# Altium project BOC1_06.PrjPcb (part 1 of 2)
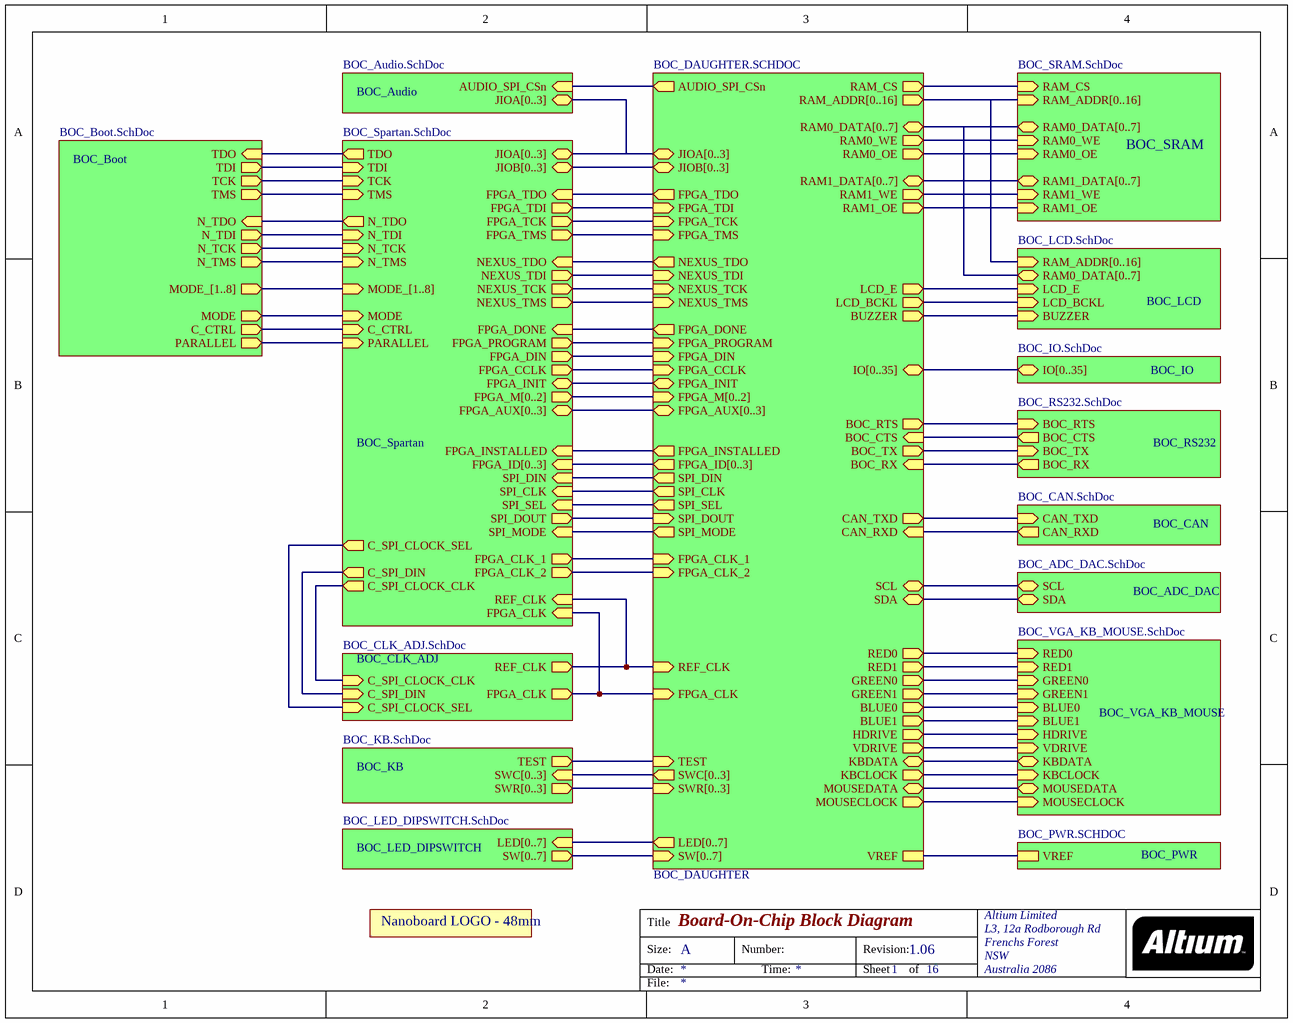
[diagram p0: BOC_Top.SchDoc]
16 sheets, 311 parts. Net scope: hierarchical (ports join the sheet entries above them; power ports are global).
Board file: BOC1_06.PcbDoc
Sheets:
  BOC_Top.SchDoc
    BOC_SRAM = BOC_SRAM.SchDoc
    BOC_IO = BOC_IO.SchDoc
    BOC_KB = BOC_KB.SchDoc
    BOC_PWR = BOC_PWR.SchDoc
    BOC_RS232 = BOC_RS232.SchDoc
    BOC_ADC_DAC = BOC_ADC_DAC.SchDoc
    BOC_CAN = BOC_CAN.SchDoc
    BOC_LED_DIPSWITCH = BOC_LED_DIPSWITCH.SchDoc
    BOC_CLK_ADJ = BOC_CLK_ADJ.SchDoc
    BOC_LCD = BOC_LCD.SchDoc
    BOC_VGA_KB_MOUSE = BOC_VGA_KB_MOUSE.SchDoc
    BOC_Spartan = BOC_Spartan.SchDoc
    BOC_DAUGHTER = BOC_DAUGHTER.SchDoc
    BOC_Boot = BOC_Boot.SchDoc
    BOC_Audio = BOC_Audio.SchDoc

## Sheet BOC_Top.SchDoc: Board-On-Chip Block Diagram
size A; Organization: Altium Limited; Address1: L3, 12a Rodborough Rd; Address2: Frenchs Forest; Address3: NSW; Address4: Australia 2086; Revision: 1.06; SheetNumber: 1; SheetTotal: 16

### Parts
LOGO1  NanoboardLogo48mm  [NanoboardLogo48mm]  (value not drawn)  (graphical)

### Sub-sheets
BOC_ADC_DAC = BOC_ADC_DAC.SchDoc: SCL (bidir), SDA (bidir)
BOC_Audio = BOC_Audio.SchDoc: AUDIO_SPI_CSn (in), JIOA[0..3] (bidir)
BOC_Boot = BOC_Boot.SchDoc: TCK (out), TDO (in), TDI (out), TMS (out), C_CTRL (out), PARALLEL (out), MODE_[1..8] (out), N_TDI (out), N_TDO (in), N_TCK (out), N_TMS (out), MODE (out)
BOC_CAN = BOC_CAN.SchDoc: CAN_TXD (in), CAN_RXD (out)
BOC_CLK_ADJ = BOC_CLK_ADJ.SchDoc: FPGA_CLK (out), REF_CLK (out), C_SPI_CLOCK_SEL (in), C_SPI_DIN (in), C_SPI_CLOCK_CLK (in)
BOC_DAUGHTER = BOC_DAUGHTER.SCHDOC: FPGA_DONE (out), FPGA_PROGRAM (in), FPGA_CCLK (in), FPGA_DIN (in), IO[0..35] (bidir), BOC_RTS (out), BOC_TX (out), BOC_CTS (in), BOC_RX (in), CAN_TXD (out), CAN_RXD (in), JIOA[0..3] (bidir), JIOB[0..3] (bidir), LED[0..7] (out), SW[0..7] (in), LCD_BCKL (out), FPGA_AUX[0..3] (bidir), FPGA_M[0..2] (in), FPGA_TDI (in), FPGA_TCK (in), FPGA_TMS (in), FPGA_TDO (out), RAM_ADDR[0..16] (out), RAM0_DATA[0..7] (bidir), RAM1_DATA[0..7] (bidir), RAM0_OE (out), RAM0_WE (out), RAM1_OE (out), RAM1_WE (out), RAM_CS (out), RED0 (out), RED1 (out), GREEN0 (out), GREEN1 (out), BLUE0 (out), BLUE1 (out), HDRIVE (out), VDRIVE (out), KBDATA (bidir), KBCLOCK (out), MOUSEDATA (bidir), MOUSECLOCK (out), SWC[0..3] (out), SWR[0..3] (in), FPGA_CLK (in), TEST (in), SCL (bidir), SDA (bidir), NEXUS_TDI (in), NEXUS_TCK (in), NEXUS_TMS (in), NEXUS_TDO (out), BUZZER (out), FPGA_INIT (bidir), VREF, SPI_MODE (out), SPI_DOUT (in), SPI_SEL (out), SPI_CLK (out), SPI_DIN (out), FPGA_CLK_1 (in), FPGA_CLK_2 (in), FPGA_INSTALLED (out), REF_CLK (in), FPGA_ID[0..3] (out), LCD_E (out), AUDIO_SPI_CSn (out)
BOC_IO = BOC_IO.SchDoc: IO[0..35] (bidir)
BOC_KB = BOC_KB.SchDoc: SWC[0..3] (in), SWR[0..3] (out), TEST (out)
BOC_LCD = BOC_LCD.SchDoc: RAM0_DATA[0..7] (bidir), LCD_BCKL (in), RAM_ADDR[0..16] (in), BUZZER (in), LCD_E (in)
BOC_LED_DIPSWITCH = BOC_LED_DIPSWITCH.SchDoc: LED[0..7] (in), SW[0..7] (out)
BOC_PWR = BOC_PWR.SCHDOC: VREF
BOC_RS232 = BOC_RS232.SchDoc: BOC_RTS (in), BOC_TX (in), BOC_CTS (out), BOC_RX (out)
BOC_Spartan = BOC_Spartan.SchDoc: FPGA_TDI (out), FPGA_TCK (out), FPGA_TMS (out), FPGA_TDO (in), FPGA_DONE (in), FPGA_PROGRAM (out), FPGA_CCLK (out), FPGA_DIN (out), FPGA_AUX[0..3] (bidir), FPGA_M[0..2] (out), JIOA[0..3] (bidir), JIOB[0..3] (bidir), REF_CLK (in), FPGA_INIT (bidir), NEXUS_TDO (in), NEXUS_TDI (out), NEXUS_TCK (out), NEXUS_TMS (out), FPGA_CLK_1 (out), FPGA_CLK_2 (out), FPGA_INSTALLED (in), SPI_DIN (in), SPI_CLK (in), SPI_SEL (in), SPI_DOUT (out), SPI_MODE (in), C_SPI_CLOCK_CLK (out), C_SPI_DIN (out), C_SPI_CLOCK_SEL (out), FPGA_ID[0..3] (in), TCK (in), TDO (out), TDI (in), TMS (in), C_CTRL (in), PARALLEL (in), MODE_[1..8] (in), N_TDI (in), N_TDO (out), N_TCK (in), N_TMS (in), MODE (in), FPGA_CLK (in)
BOC_SRAM = BOC_SRAM.SchDoc: RAM_ADDR[0..16] (in), RAM1_DATA[0..7] (bidir), RAM0_WE (in), RAM0_OE (in), RAM1_WE (in), RAM1_OE (in), RAM_CS (in), RAM0_DATA[0..7] (bidir)
BOC_VGA_KB_MOUSE = BOC_VGA_KB_MOUSE.SchDoc: RED0 (in), RED1 (in), GREEN0 (in), GREEN1 (in), BLUE0 (in), BLUE1 (in), HDRIVE (in), VDRIVE (in), KBDATA (bidir), KBCLOCK (in), MOUSEDATA (bidir), MOUSECLOCK (in)

### Nets
AUDIO_SPI_CSn: sheet BOC_DAUGHTER/AUDIO_SPI_CSn, sheet BOC_Audio/AUDIO_SPI_CSn
BLUE0: sheet BOC_VGA_KB_MOUSE/BLUE0, sheet BOC_DAUGHTER/BLUE0
BLUE1: sheet BOC_VGA_KB_MOUSE/BLUE1, sheet BOC_DAUGHTER/BLUE1
BOC_CTS: sheet BOC_RS232/BOC_CTS, sheet BOC_DAUGHTER/BOC_CTS
BOC_RTS: sheet BOC_RS232/BOC_RTS, sheet BOC_DAUGHTER/BOC_RTS
BOC_RX: sheet BOC_RS232/BOC_RX, sheet BOC_DAUGHTER/BOC_RX
BOC_TX: sheet BOC_RS232/BOC_TX, sheet BOC_DAUGHTER/BOC_TX
BUZZER: sheet BOC_LCD/BUZZER, sheet BOC_DAUGHTER/BUZZER
C_CTRL: sheet BOC_Spartan/C_CTRL, sheet BOC_Boot/C_CTRL
C_SPI_CLOCK_CLK: sheet BOC_CLK_ADJ/C_SPI_CLOCK_CLK, sheet BOC_Spartan/C_SPI_CLOCK_CLK
C_SPI_CLOCK_SEL: sheet BOC_CLK_ADJ/C_SPI_CLOCK_SEL, sheet BOC_Spartan/C_SPI_CLOCK_SEL
C_SPI_DIN: sheet BOC_CLK_ADJ/C_SPI_DIN, sheet BOC_Spartan/C_SPI_DIN
CAN_RXD: sheet BOC_CAN/CAN_RXD, sheet BOC_DAUGHTER/CAN_RXD
CAN_TXD: sheet BOC_CAN/CAN_TXD, sheet BOC_DAUGHTER/CAN_TXD
FPGA_CCLK: sheet BOC_Spartan/FPGA_CCLK, sheet BOC_DAUGHTER/FPGA_CCLK
FPGA_CLK: sheet BOC_CLK_ADJ/FPGA_CLK, sheet BOC_Spartan/FPGA_CLK, sheet BOC_DAUGHTER/FPGA_CLK
FPGA_CLK_1: sheet BOC_Spartan/FPGA_CLK_1, sheet BOC_DAUGHTER/FPGA_CLK_1
FPGA_CLK_2: sheet BOC_Spartan/FPGA_CLK_2, sheet BOC_DAUGHTER/FPGA_CLK_2
FPGA_DIN: sheet BOC_Spartan/FPGA_DIN, sheet BOC_DAUGHTER/FPGA_DIN
FPGA_DONE: sheet BOC_Spartan/FPGA_DONE, sheet BOC_DAUGHTER/FPGA_DONE
FPGA_INIT: sheet BOC_Spartan/FPGA_INIT, sheet BOC_DAUGHTER/FPGA_INIT
FPGA_INSTALLED: sheet BOC_Spartan/FPGA_INSTALLED, sheet BOC_DAUGHTER/FPGA_INSTALLED
FPGA_PROGRAM: sheet BOC_Spartan/FPGA_PROGRAM, sheet BOC_DAUGHTER/FPGA_PROGRAM
FPGA_TCK: sheet BOC_Spartan/FPGA_TCK, sheet BOC_DAUGHTER/FPGA_TCK
FPGA_TDI: sheet BOC_Spartan/FPGA_TDI, sheet BOC_DAUGHTER/FPGA_TDI
FPGA_TDO: sheet BOC_Spartan/FPGA_TDO, sheet BOC_DAUGHTER/FPGA_TDO
FPGA_TMS: sheet BOC_Spartan/FPGA_TMS, sheet BOC_DAUGHTER/FPGA_TMS
GREEN0: sheet BOC_VGA_KB_MOUSE/GREEN0, sheet BOC_DAUGHTER/GREEN0
GREEN1: sheet BOC_VGA_KB_MOUSE/GREEN1, sheet BOC_DAUGHTER/GREEN1
HDRIVE: sheet BOC_VGA_KB_MOUSE/HDRIVE, sheet BOC_DAUGHTER/HDRIVE
KBCLOCK: sheet BOC_VGA_KB_MOUSE/KBCLOCK, sheet BOC_DAUGHTER/KBCLOCK
KBDATA: sheet BOC_VGA_KB_MOUSE/KBDATA, sheet BOC_DAUGHTER/KBDATA
LCD_BCKL: sheet BOC_LCD/LCD_BCKL, sheet BOC_DAUGHTER/LCD_BCKL
LCD_E: sheet BOC_LCD/LCD_E, sheet BOC_DAUGHTER/LCD_E
MODE: sheet BOC_Spartan/MODE, sheet BOC_Boot/MODE
MOUSECLOCK: sheet BOC_VGA_KB_MOUSE/MOUSECLOCK, sheet BOC_DAUGHTER/MOUSECLOCK
MOUSEDATA: sheet BOC_VGA_KB_MOUSE/MOUSEDATA, sheet BOC_DAUGHTER/MOUSEDATA
N_TCK: sheet BOC_Spartan/N_TCK, sheet BOC_Boot/N_TCK
N_TDI: sheet BOC_Spartan/N_TDI, sheet BOC_Boot/N_TDI
N_TDO: sheet BOC_Spartan/N_TDO, sheet BOC_Boot/N_TDO
N_TMS: sheet BOC_Spartan/N_TMS, sheet BOC_Boot/N_TMS
NEXUS_TCK: sheet BOC_Spartan/NEXUS_TCK, sheet BOC_DAUGHTER/NEXUS_TCK
NEXUS_TDI: sheet BOC_Spartan/NEXUS_TDI, sheet BOC_DAUGHTER/NEXUS_TDI
NEXUS_TDO: sheet BOC_Spartan/NEXUS_TDO, sheet BOC_DAUGHTER/NEXUS_TDO
NEXUS_TMS: sheet BOC_Spartan/NEXUS_TMS, sheet BOC_DAUGHTER/NEXUS_TMS
PARALLEL: sheet BOC_Spartan/PARALLEL, sheet BOC_Boot/PARALLEL
RAM0_OE: sheet BOC_SRAM/RAM0_OE, sheet BOC_DAUGHTER/RAM0_OE
RAM0_WE: sheet BOC_SRAM/RAM0_WE, sheet BOC_DAUGHTER/RAM0_WE
RAM1_OE: sheet BOC_SRAM/RAM1_OE, sheet BOC_DAUGHTER/RAM1_OE
RAM1_WE: sheet BOC_SRAM/RAM1_WE, sheet BOC_DAUGHTER/RAM1_WE
RAM_CS: sheet BOC_SRAM/RAM_CS, sheet BOC_DAUGHTER/RAM_CS
RED0: sheet BOC_VGA_KB_MOUSE/RED0, sheet BOC_DAUGHTER/RED0
RED1: sheet BOC_VGA_KB_MOUSE/RED1, sheet BOC_DAUGHTER/RED1
REF_CLK: sheet BOC_CLK_ADJ/REF_CLK, sheet BOC_Spartan/REF_CLK, sheet BOC_DAUGHTER/REF_CLK
SCL: sheet BOC_ADC_DAC/SCL, sheet BOC_DAUGHTER/SCL
SDA: sheet BOC_ADC_DAC/SDA, sheet BOC_DAUGHTER/SDA
SPI_CLK: sheet BOC_Spartan/SPI_CLK, sheet BOC_DAUGHTER/SPI_CLK
SPI_DIN: sheet BOC_Spartan/SPI_DIN, sheet BOC_DAUGHTER/SPI_DIN
SPI_DOUT: sheet BOC_Spartan/SPI_DOUT, sheet BOC_DAUGHTER/SPI_DOUT
SPI_MODE: sheet BOC_Spartan/SPI_MODE, sheet BOC_DAUGHTER/SPI_MODE
SPI_SEL: sheet BOC_Spartan/SPI_SEL, sheet BOC_DAUGHTER/SPI_SEL
TCK: sheet BOC_Spartan/TCK, sheet BOC_Boot/TCK
TDI: sheet BOC_Spartan/TDI, sheet BOC_Boot/TDI
TDO: sheet BOC_Spartan/TDO, sheet BOC_Boot/TDO
TEST: sheet BOC_KB/TEST, sheet BOC_DAUGHTER/TEST
TMS: sheet BOC_Spartan/TMS, sheet BOC_Boot/TMS
VDRIVE: sheet BOC_VGA_KB_MOUSE/VDRIVE, sheet BOC_DAUGHTER/VDRIVE
VREF: sheet BOC_PWR/VREF, sheet BOC_DAUGHTER/VREF

### Buses and harness runs
bus sheet BOC_Audio/JIOA[0..3] = sheet BOC_DAUGHTER/JIOA[0..3] = sheet BOC_Spartan/JIOA[0..3]
bus sheet BOC_Boot/MODE_[1..8] = sheet BOC_Spartan/MODE_[1..8]
bus sheet BOC_DAUGHTER/FPGA_AUX[0..3] = sheet BOC_Spartan/FPGA_AUX[0..3]
bus sheet BOC_DAUGHTER/FPGA_ID[0..3] = sheet BOC_Spartan/FPGA_ID[0..3]
bus sheet BOC_DAUGHTER/FPGA_M[0..2] = sheet BOC_Spartan/FPGA_M[0..2]
bus sheet BOC_DAUGHTER/IO[0..35] = sheet BOC_IO/IO[0..35]
bus sheet BOC_DAUGHTER/JIOB[0..3] = sheet BOC_Spartan/JIOB[0..3]
bus sheet BOC_DAUGHTER/LED[0..7] = sheet BOC_LED_DIPSWITCH/LED[0..7]
bus sheet BOC_DAUGHTER/RAM0_DATA[0..7] = sheet BOC_LCD/RAM0_DATA[0..7] = sheet BOC_SRAM/RAM0_DATA[0..7]
bus sheet BOC_DAUGHTER/RAM1_DATA[0..7] = sheet BOC_SRAM/RAM1_DATA[0..7]
bus sheet BOC_DAUGHTER/RAM_ADDR[0..16] = sheet BOC_LCD/RAM_ADDR[0..16] = sheet BOC_SRAM/RAM_ADDR[0..16]
bus sheet BOC_DAUGHTER/SW[0..7] = sheet BOC_LED_DIPSWITCH/SW[0..7]
bus sheet BOC_DAUGHTER/SWC[0..3] = sheet BOC_KB/SWC[0..3]
bus sheet BOC_DAUGHTER/SWR[0..3] = sheet BOC_KB/SWR[0..3]

### Notes on the sheet
- Title
- Size:
- Date:
- A
- Number:
- Time:
- Revision:
- Sheet
- of
- File:
- (in symbol NanoboardLogo48mm) Nanoboard LOGO - 48mm

## Sheet BOC_SRAM.SchDoc: Board-On-Chip Static Ram 128k
size A; Organization: Altium Limited; Address1: L3, 12a Rodborough Rd; Address2: Frenchs Forest; Address3: NSW; Address4: Australia 2086; Revision: 1.06; SheetNumber: 9; SheetTotal: 16
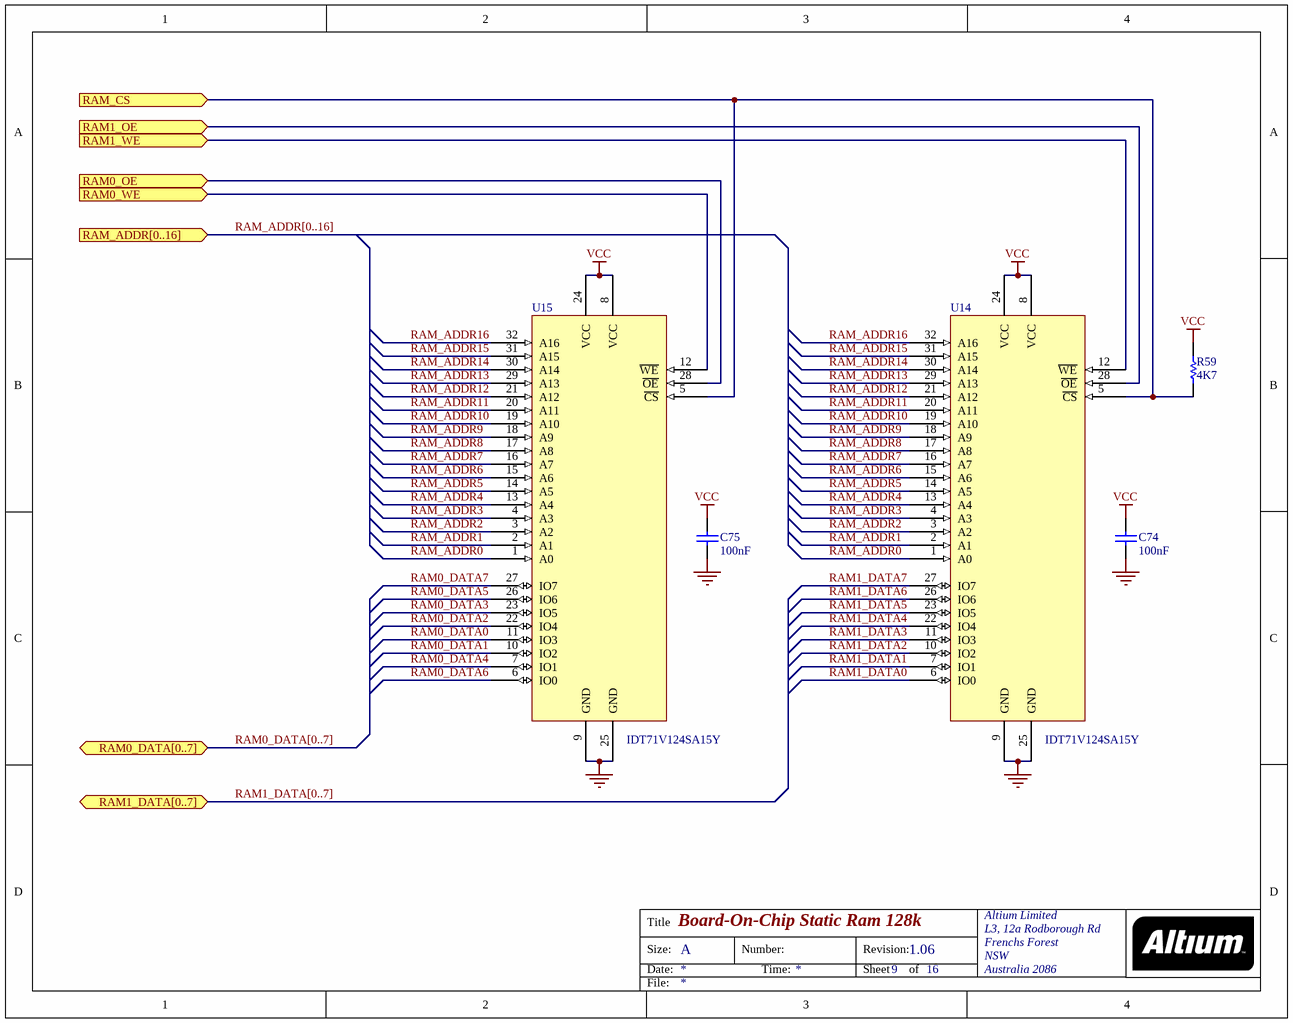
[diagram p1: BOC_SRAM.SchDoc]

### Parts
C74  100nF  [CC2012-0805]
C75  100nF  [CC2012-0805]
R59  4K7  [CC2012-0805]
U14  IDT71V124SA15Y  [SO-J32]
U15  IDT71V124SA15Y  [SO-J32]

### Ports
RAM0_DATA[0..7] (bidir), RAM0_OE (in), RAM0_WE (in), RAM1_DATA[0..7] (bidir), RAM1_OE (in), RAM1_WE (in), RAM_ADDR[0..16] (in), RAM_CS (in)

### Nets
GND: C74.2 C75.2 U14.9(GND) U14.25(GND) U15.9(GND) U15.25(GND)
VCC: C74.1 C75.1 R59.1 U14.8(VCC) U14.24(VCC) U15.8(VCC) U15.24(VCC)
RAM0_DATA0: U15.11(IO3)
RAM0_DATA1: U15.10(IO2)
RAM0_DATA2: U15.22(IO4)
RAM0_DATA3: U15.23(IO5)
RAM0_DATA4: U15.7(IO1)
RAM0_DATA5: U15.26(IO6)
RAM0_DATA6: U15.6(IO0)
RAM0_DATA7: U15.27(IO7)
RAM0_OE: U15.28(~{OE}) ; port RAM0_OE
RAM0_WE: U15.12(~{WE}) ; port RAM0_WE
RAM1_DATA0: U14.6(IO0)
RAM1_DATA1: U14.7(IO1)
RAM1_DATA2: U14.10(IO2)
RAM1_DATA3: U14.11(IO3)
RAM1_DATA4: U14.22(IO4)
RAM1_DATA5: U14.23(IO5)
RAM1_DATA6: U14.26(IO6)
RAM1_DATA7: U14.27(IO7)
RAM1_OE: U14.28(~{OE}) ; port RAM1_OE
RAM1_WE: U14.12(~{WE}) ; port RAM1_WE
RAM_ADDR0: U14.1(A0) U15.1(A0)
RAM_ADDR1: U14.2(A1) U15.2(A1)
RAM_ADDR2: U14.3(A2) U15.3(A2)
RAM_ADDR3: U14.4(A3) U15.4(A3)
RAM_ADDR4: U14.13(A4) U15.13(A4)
RAM_ADDR5: U14.14(A5) U15.14(A5)
RAM_ADDR6: U14.15(A6) U15.15(A6)
RAM_ADDR7: U14.16(A7) U15.16(A7)
RAM_ADDR8: U14.17(A8) U15.17(A8)
RAM_ADDR9: U14.18(A9) U15.18(A9)
RAM_ADDR10: U14.19(A10) U15.19(A10)
RAM_ADDR11: U14.20(A11) U15.20(A11)
RAM_ADDR12: U14.21(A12) U15.21(A12)
RAM_ADDR13: U14.29(A13) U15.29(A13)
RAM_ADDR14: U14.30(A14) U15.30(A14)
RAM_ADDR15: U14.31(A15) U15.31(A15)
RAM_ADDR16: U14.32(A16) U15.32(A16)
RAM_CS: R59.2 U14.5(~{CS}) U15.5(~{CS}) ; port RAM_CS

### Buses and harness runs
bus RAM0_DATA[0..7] = port RAM0_DATA[0..7]
bus RAM1_DATA[0..7] = port RAM1_DATA[0..7]
bus RAM_ADDR[0..16] = port RAM_ADDR[0..16]

### Notes on the sheet
- Title
- Size:
- Date:
- A
- Number:
- Time:
- Revision:
- Sheet
- of
- File:

### Library data of the parts
C74 C75 = CAP: Capacitor; Fitted: True; Supplier: FARNELL; Supplier Code: 317-287
R59 = RES: Resistor; Fitted: True
U14 U15 = IDT71V124SA15Y: 128K x 8 bit Fast Static RAM; Fitted: True; Supplier: IDT

## Sheet BOC_IO.SchDoc: Board-On-Chip User Header Ports
size A; Organization: Altium Limited; Address1: L3, 12a Rodborough Rd; Address2: Frenchs Forest; Address3: NSW; Address4: Australia 2086; Revision: 1.06; SheetNumber: 11; SheetTotal: 16
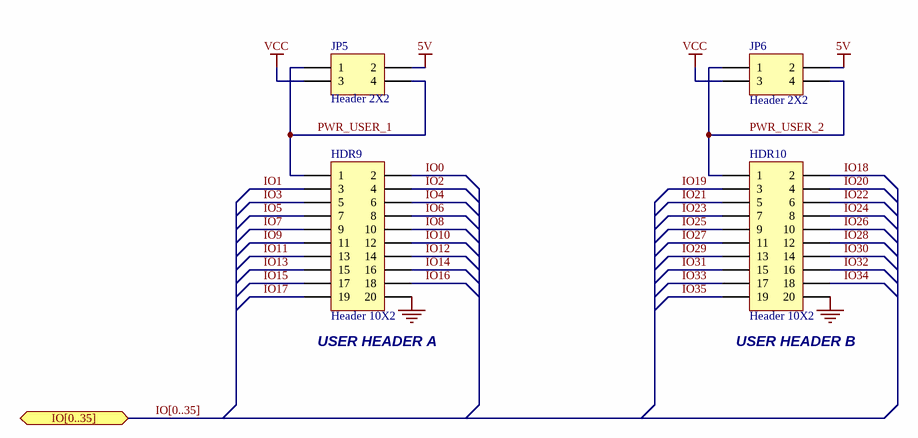
[diagram p2: BOC_IO.SchDoc]

### Parts
HDR9  Header 10X2  [HDR2X10]
HDR10  Header 10X2  [HDR2X10]
JP5  Header 2X2  [HDR2X2_B]
JP6  Header 2X2  [HDR2X2_B]

### Ports
IO[0..35] (bidir)

### Nets
5V: JP5.2 JP6.2
GND: HDR9.20 HDR10.20
VCC: JP5.3 JP6.3
IO0: HDR9.2
IO1: HDR9.3
IO2: HDR9.4
IO3: HDR9.5
IO4: HDR9.6
IO5: HDR9.7
IO6: HDR9.8
IO7: HDR9.9
IO8: HDR9.10
IO9: HDR9.11
IO10: HDR9.12
IO11: HDR9.13
IO12: HDR9.14
IO13: HDR9.15
IO14: HDR9.16
IO15: HDR9.17
IO16: HDR9.18
IO17: HDR9.19
IO18: HDR10.2
IO19: HDR10.3
IO20: HDR10.4
IO21: HDR10.5
IO22: HDR10.6
IO23: HDR10.7
IO24: HDR10.8
IO25: HDR10.9
IO26: HDR10.10
IO27: HDR10.11
IO28: HDR10.12
IO29: HDR10.13
IO30: HDR10.14
IO31: HDR10.15
IO32: HDR10.16
IO33: HDR10.17
IO34: HDR10.18
IO35: HDR10.19
PWR_USER_1: HDR9.1 JP5.1 JP5.4
PWR_USER_2: HDR10.1 JP6.1 JP6.4

### Buses and harness runs
bus IO[0..35] = port IO[0..35]

### Notes on the sheet
- (near HDR9) USER HEADER A
- (near HDR10) USER HEADER B
- Title
- Size:
- Date:
- A
- Number:
- Time:
- Revision:
- Sheet
- of
- File:

### Library data of the parts
HDR9 HDR10 = Header 10X2: Header, 10-Pin, Dual row; Manufacturer: Generic Components; Class I: Connector; Fitted: True; Revision: July-2002: Re-released for DXP Platform.; Publisher: Altium Limited
JP5 JP6 = Header 2X2: Header, 2-Pin, Dual row; Manufacturer: Generic Components; Class I: Connector; Fitted: True; Revision: July-2002: Re-released for DXP Platform.; Publisher: Altium Limited

## Sheet BOC_KB.SchDoc: Board-On-Chip Keyboard
size A; Organization: Altium Limited; Address1: L3, 12a Rodborough Rd; Address2: Frenchs Forest; Address3: NSW; Address4: Australia 2086; Revision: 1.06; SheetNumber: 6; SheetTotal: 16
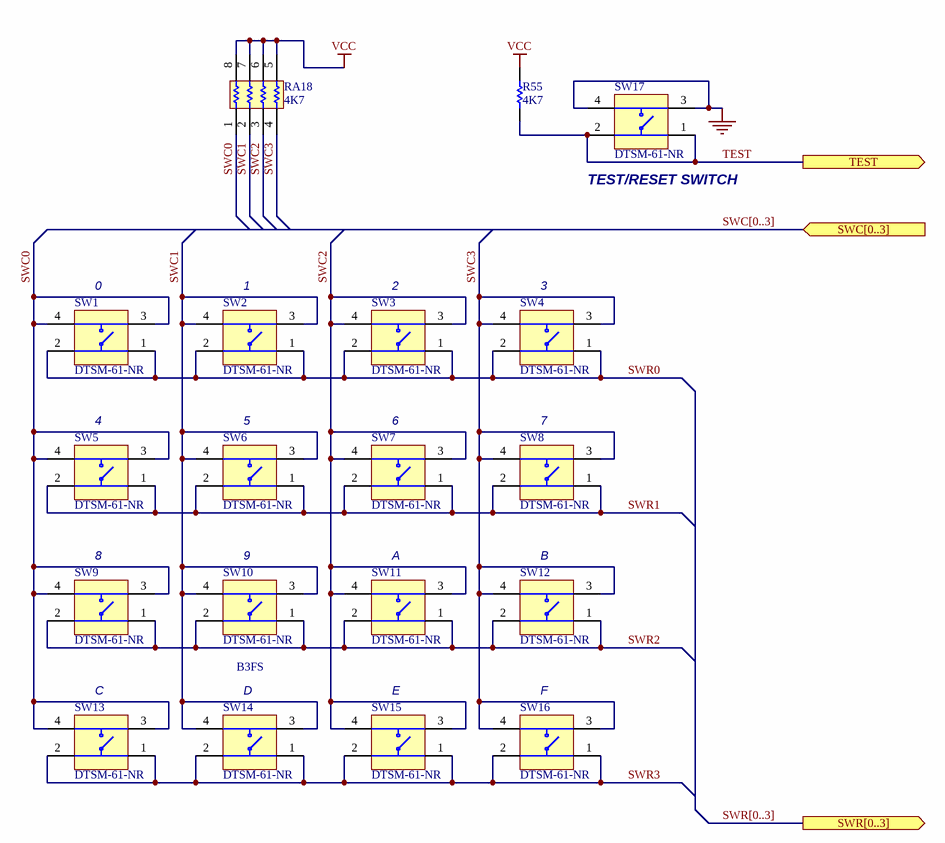
[diagram p3: BOC_KB.SchDoc]

### Parts
R55  4K7  [CC2012-0805]
RA18  4K7  [MNR34]
SW1  DTSM-61-NR  [B3FS_SWITCH]
SW2  DTSM-61-NR  [B3FS_SWITCH]
SW3  DTSM-61-NR  [B3FS_SWITCH]
SW4  DTSM-61-NR  [B3FS_SWITCH]
SW5  DTSM-61-NR  [B3FS_SWITCH]
SW6  DTSM-61-NR  [B3FS_SWITCH]
SW7  DTSM-61-NR  [B3FS_SWITCH]
SW8  DTSM-61-NR  [B3FS_SWITCH]
SW9  DTSM-61-NR  [B3FS_SWITCH]
SW10  DTSM-61-NR  [B3FS_SWITCH]
SW11  DTSM-61-NR  [B3FS_SWITCH]
SW12  DTSM-61-NR  [B3FS_SWITCH]
SW13  DTSM-61-NR  [B3FS_SWITCH]
SW14  DTSM-61-NR  [B3FS_SWITCH]
SW15  DTSM-61-NR  [B3FS_SWITCH]
SW16  DTSM-61-NR  [B3FS_SWITCH]
SW17  DTSM-61-NR  [B3FS_SWITCH]

### Ports
SWC[0..3] (in), SWR[0..3] (out), TEST (out)

### Nets
GND: SW17.3 SW17.4
VCC: R55.1 RA18.5 RA18.6 RA18.7 RA18.8
SWC0: RA18.1 SW1.3 SW1.4 SW5.3 SW5.4 SW9.3 SW9.4 SW13.3 SW13.4
SWC1: RA18.2 SW2.3 SW2.4 SW6.3 SW6.4 SW10.3 SW10.4 SW14.3 SW14.4
SWC2: RA18.3 SW3.3 SW3.4 SW7.3 SW7.4 SW11.3 SW11.4 SW15.3 SW15.4
SWC3: RA18.4 SW4.3 SW4.4 SW8.3 SW8.4 SW12.3 SW12.4 SW16.3 SW16.4
SWR0: SW1.1 SW1.2 SW2.1 SW2.2 SW3.1 SW3.2 SW4.1 SW4.2
SWR1: SW5.1 SW5.2 SW6.1 SW6.2 SW7.1 SW7.2 SW8.1 SW8.2
SWR2: SW9.1 SW9.2 SW10.1 SW10.2 SW11.1 SW11.2 SW12.1 SW12.2
SWR3: SW13.1 SW13.2 SW14.1 SW14.2 SW15.1 SW15.2 SW16.1 SW16.2
TEST: R55.2 SW17.1 SW17.2 ; port TEST

### Buses and harness runs
bus SWC[0..3] = port SWC[0..3]
bus SWR[0..3] = port SWR[0..3]

### Notes on the sheet
- (near SW17) TEST/RESET SWITCH
- (near SW1) 0
- (near SW2) 1
- (near SW3) 2
- (near SW4) 3
- (near SW5) 4
- (near SW6) 5
- (near SW7) 6
- (near SW8) 7
- (near SW9) 8
- (near SW10) 9
- (near SW11) A
- (near SW12) B
- (near SW13) C
- (near SW14) D
- (near SW15) E
- (near SW16) F
- Title
- Size:
- Date:
- Number:
- Time:
- Revision:
- Sheet
- of
- File:

### Library data of the parts
R55 = RES: Resistor; Fitted: True
RA18 = MNR34: 3216x4 Resistor Array; Fitted: True
SW1-SW17 = B3FS: SPNA SMD Keyboard Switch; Fitted: True
  SW1 SW10: Comment_1: B3FS

## Sheet BOC_PWR.SchDoc: Board-On-Chip Power Supply
size A; Organization: Altium Limited; Address1: L3, 12a Rodborough Rd; Address2: Frenchs Forest; Address3: NSW; Address4: Australia 2086; Revision: 1.06; SheetNumber: 16; SheetTotal: 16
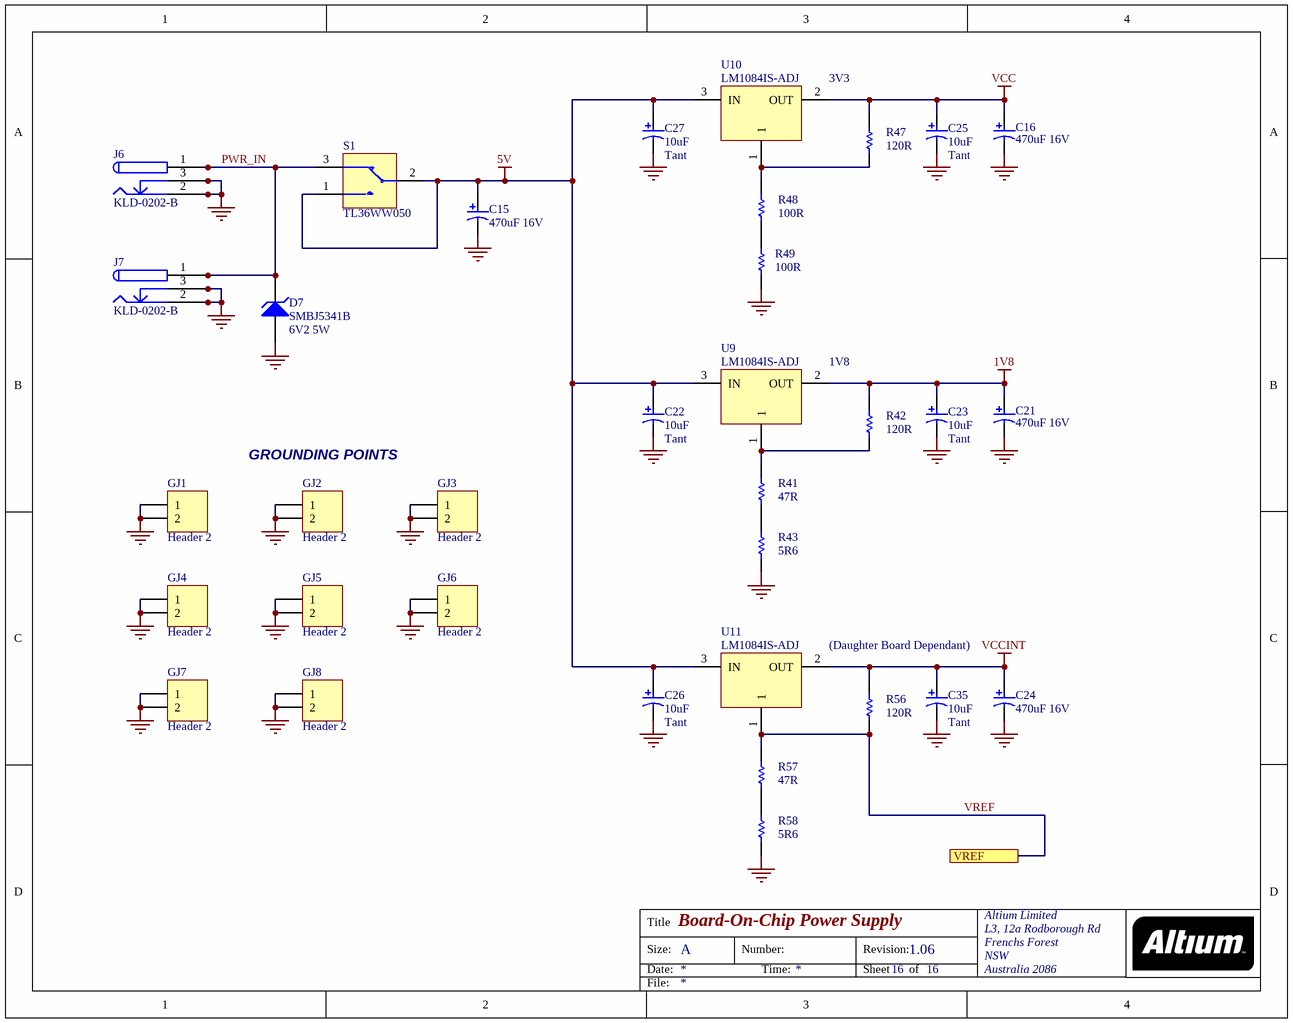
[diagram p4: BOC_PWR.SchDoc]

### Parts
C15  470uF 16V  [RB8/3.5]
C16  470uF 16V  [RB8/3.5]
C21  470uF 16V  [RB8/3.5]
C22  10uF  Capacitor Type: Tant  [MCCT-B]
C23  10uF  Capacitor Type: Tant  [MCCT-B]
C24  470uF 16V  [RB8/3.5]
C25  10uF  Capacitor Type: Tant  [MCCT-B]
C26  10uF  Capacitor Type: Tant  [MCCT-B]
C27  10uF  Capacitor Type: Tant  [MCCT-B]
C35  10uF  Capacitor Type: Tant  [MCCT-B]
D7  SMBJ5341B  Part Description: 6V2 5W  [DO214]
GJ1  Header 2  [HDR1X2]
GJ2  Header 2  [HDR1X2]
GJ3  Header 2  [HDR1X2]
GJ4  Header 2  [HDR1X2]
GJ5  Header 2  [HDR1X2]
GJ6  Header 2  [HDR1X2]
GJ7  Header 2  [HDR1X2]
GJ8  Header 2  [HDR1X2]
J6  KLD-0202-B  [KLD-0202]
J7  KLD-0202-B  [KLD-0202]
R41  47R  [CC2012-0805]
R42  120R  [CC2012-0805]
R43  5R6  [CC2012-0805]
R47  120R  [CC2012-0805]
R48  100R  [CC2012-0805]
R49  100R  [CC2012-0805]
R56  120R  [CC2012-0805]
R57  47R  [CC2012-0805]
R58  5R6  [CC2012-0805]
S1  TL36WW050  [TL36WW15050]
U9  LM1084IS-ADJ  [TO-263]
U10  LM1084IS-ADJ  [TO-263]
U11  LM1084IS-ADJ  [TO-263]

### Ports
VREF

### Nets
1V8: C21.1 C23.1 R42.1 U9.2(OUT)
5V: C15.1 C22.1 C26.1 C27.1 S1.1 S1.2 U9.3(IN) U10.3(IN) U11.3(IN)
GND: C15.2 C16.2 C21.2 C22.2 C23.2 C24.2 C25.2 C26.2 C27.2 C35.2 D7.1(A) GJ1.1 GJ1.2 GJ2.1 GJ2.2 GJ3.1 GJ3.2 GJ4.1 GJ4.2 GJ5.1 GJ5.2 GJ6.1 GJ6.2 GJ7.1 GJ7.2 GJ8.1 GJ8.2 J6.2 J6.2A J6.2B J6.3 J6.3A J6.3B J7.2 J7.2A J7.2B J7.3 J7.3A J7.3B R43.2 R49.1 R58.2
VCC: C16.1 C25.1 R47.1 U10.2(OUT)
VCCINT: C24.1 C35.1 R56.1 U11.2(OUT)
PWR_IN: D7.2(K) J6.1 J6.1A J6.1B J7.1 J7.1A J7.1B S1.3
VREF: R56.2 R57.1 U11.1 ; port VREF
NetR41_1: R41.1 R42.2 U9.1
NetR41_2: R41.2 R43.1
NetR47_2: R47.2 R48.1 U10.1
NetR48_2: R48.2 R49.2
NetR57_2: R57.2 R58.1

### Notes on the sheet
- 3V3
- 1V8
- (near GJ2) GROUNDING POINTS
- (Daughter Board Dependant)
- Title
- Size:
- Date:
- A
- Number:
- Time:
- Revision:
- Sheet
- of
- File:

### Library data of the parts
C15 C16 C21-C27 C35 = CAP_POLAR: Polar Capacitor; Fitted: True
D7 = BZG03C13: Zener Diode, 6.2V, 5W; Manufacturer: Microsemi; Fitted: True; Revision: 31-Oct-2003
GJ1-GJ8 = Header 2: Header, 2-Pin; Manufacturer: Generic Components; Class I: Connector; Fitted: True; Revision: July-2002: Re-released for DXP Platform.; Publisher: Altium Limited
J6 J7 = KLD-0202-B: Low Voltage Power Supply Connector; Manufacturer: Kycon; Fitted: True
R41-R43 R47-R49 R56-R58 = RES: Resistor; Fitted: True
S1 = PCB_MOUNT_SWITCH: SPDT Subminiature Toggle Switch; Fitted: True
U9-U11 = LM1084IS-ADJ: 5A Low Dropout Possitive Regulators; Fitted: True

## Sheet BOC_RS232.SchDoc: Board-On-Chip RS232 Serial Interface
size A; Organization: Altium Limited; Address1: L3, 12a Rodborough Rd; Address2: Frenchs Forest; Address3: NSW; Address4: Australia 2086; Revision: 1.06; SheetNumber: 12; SheetTotal: 16
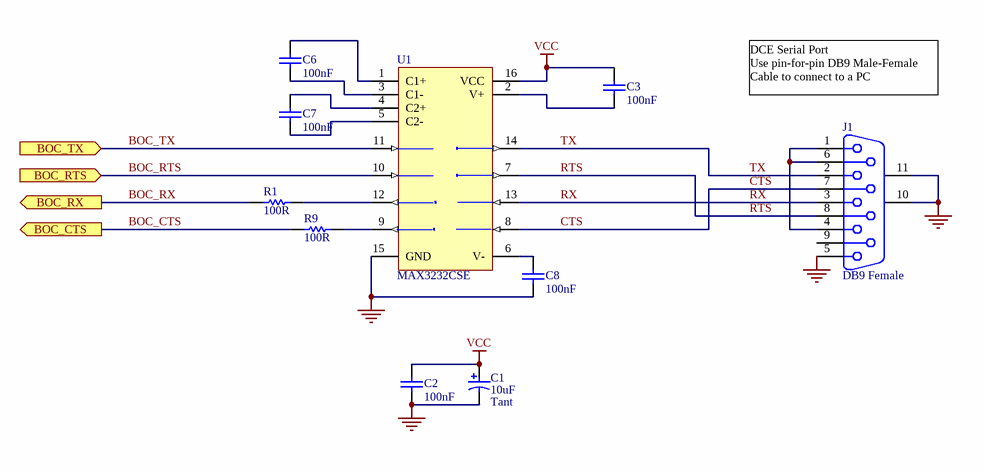
[diagram p5: BOC_RS232.SchDoc]

### Parts
C1  10uF  Capacitor Type: Tant  [MCCT-B]
C2  100nF  [CC2012-0805]
C3  100nF  [CC2012-0805]
C6  100nF  [CC2012-0805]
C7  100nF  [CC2012-0805]
C8  100nF  [CC2012-0805]
J1  DB9 Female  [DSUB1.385-2H9]
R1  100R  [CC2012-0805]
R9  100R  [CC2012-0805]
U1  MAX3232CSE  [SO-G16]

### Ports
BOC_CTS (out), BOC_RTS (in), BOC_RX (out), BOC_TX (in)

### Nets
GND: C1.2 C2.2 C8.2 J1.5 J1.10(MH1) J1.11(MH2) U1.15(GND)
VCC: C1.1 C2.1 C3.1 U1.16(VCC)
BOC_CTS: R9.1 ; port BOC_CTS
BOC_RTS: U1.10(T2IN) ; port BOC_RTS
BOC_RX: R1.1 ; port BOC_RX
BOC_TX: U1.11(T1IN) ; port BOC_TX
CTS: J1.7 U1.8(R2IN)
RTS: J1.8 U1.7(T2OUT)
RX: J1.3 U1.13(R1IN)
TX: J1.2 U1.14(T1OUT)
NetC3_2: C3.2 U1.2(V+)
NetC6_1: C6.1 U1.1(C1+)
NetC6_2: C6.2 U1.3(C1-)
NetC7_1: C7.1 U1.4(C2+)
NetC7_2: C7.2 U1.5(C2-)
NetC8_1: C8.1 U1.6(V-)
NetJ1_1: J1.1 J1.4 J1.6
NetR1_2: R1.2 U1.12(R1OUT)
NetR9_2: R9.2 U1.9(R2OUT)

Not connected (* = marked no-connect by the designer): J1 9

### Notes on the sheet
- DCE Serial Port
  Use pin-for-pin DB9 Male-Female
  Cable to connect to a PC
- Title
- Size:
- Date:
- A
- Number:
- Time:
- Revision:
- Sheet
- of
- File:

### Library data of the parts
C1 = CAP_POLAR: Polar Capacitor; Fitted: True
C2 C3 C6-C8 = CAP: Capacitor; Fitted: True
J1 = D Connector 9: Receptacle Assembly, 9 Position, Right Angle; Manufacturer: Generic Components; Package Information: Latest Revision: O; Positions: 9; Fitted: True; Published: 15-Jun-2001; Revision: July-2002: Re-released for DXP Platform.; Datasheet: (1-Sep-1999); Package Reference: 788750; Publisher: Altium Limited; Class I: Connector; Orientation: Right Angle; Gender: Receptacle
R1 R9 = RES: Resistor; Fitted: True
U1 = MAX3232EUE: 3.0V TO 5.5V, Low-Power, up to 1Mbps, True RS-232 Transceiver Using Four 0.1µF External Capacitor; Manufacturer: Maxim,ST; Package Information: Latest Revision: 21-0066 C; Class I: Communication; Published: 16-Jan-2001; Revision: July-2002: Re-released for DXP Platform.; Datasheet: Latest Revision: Mar-1999; Package Reference: TSSOP16; Publisher: Altium Limited; Class II: Transceiver; Fitted: True

## Sheet BOC_ADC_DAC.SchDoc: Board-On-Chip Analog Interface
size A; Organization: Altium Limited; Address1: L3, 12a Rodborough Rd; Address2: Frenchs Forest; Address3: NSW; Address4: Australia 2086; Revision: 1.06; SheetNumber: 14; SheetTotal: 16
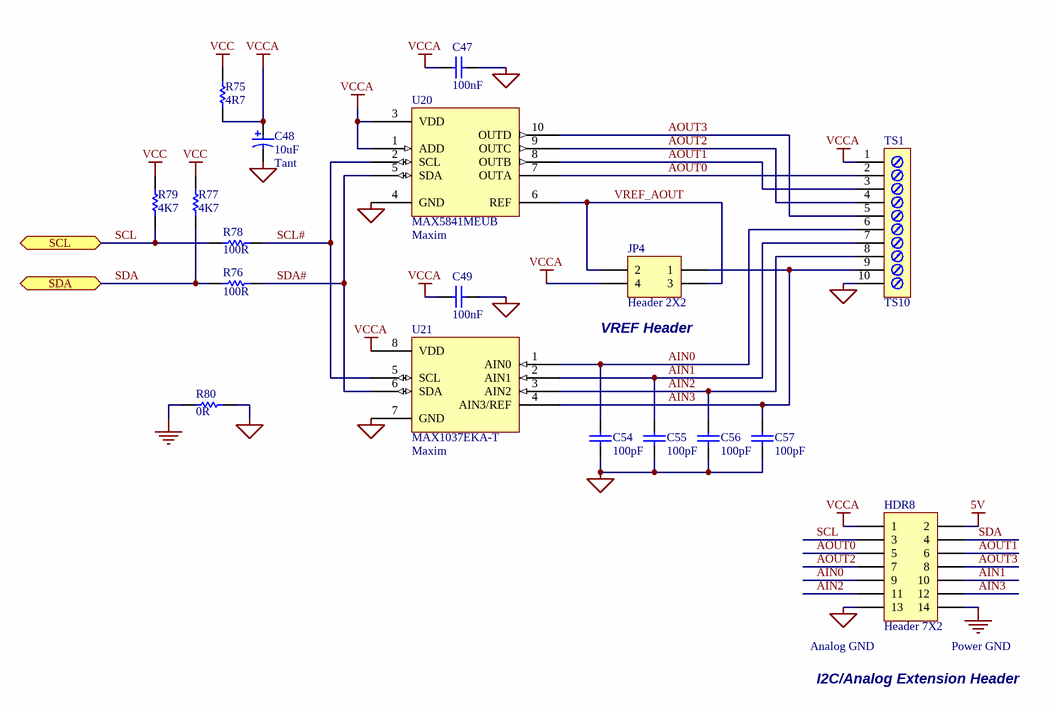
[diagram p6: BOC_ADC_DAC.SchDoc]

### Parts
C47  100nF  [CC2012-0805]
C48  10uF  Capacitor Type: Tant  [MCCT-B]
C49  100nF  [CC2012-0805]
C54  100pF  [CC2012-0805]
C55  100pF  [CC2012-0805]
C56  100pF  [CC2012-0805]
C57  100pF  [CC2012-0805]
HDR8  Header 7X2  [HDR2X7]
JP4  Header 2X2  [HDR2X2_B]
R75  4R7  [CC2012-0805]
R76  100R  [CC2012-0805]
R77  4K7  [CC2012-0805]
R78  100R  [CC2012-0805]
R79  4K7  [CC2012-0805]
R80  0R  [CC2012-0805]
TS1  TS10  [TS2.54x10]
U20  MAX5841MEUB  Supplier: Maxim  [uSOP10]
U21  MAX1037EKA-T  Manufacturer: Maxim  [SOT23_8]

### Ports
SCL (bidir), SDA (bidir)

### Nets
5V: HDR8.2
AGND: C47.2 C48.2 C49.2 C54.2 C55.2 C56.2 C57.2 HDR8.13 R80.2 TS1.10 U20.4(GND) U21.7(GND)
GND: HDR8.14 R80.1
VCC: R75.2 R77.1 R79.1
VCCA: C47.1 C48.1 C49.1 HDR8.1 JP4.4 R75.1 TS1.1 U20.1(ADD) U20.3(VDD) U21.8(VDD)
AIN0: C54.1 HDR8.9 TS1.6 U21.1(AIN0)
AIN1: C55.1 HDR8.10 TS1.7 U21.2(AIN1)
AIN2: C56.1 HDR8.11 TS1.8 U21.3(AIN2)
AIN3: C57.1 HDR8.12 JP4.1 TS1.9 U21.4(AIN3/REF)
AOUT0: HDR8.5 TS1.2 U20.7(OUTA)
AOUT1: HDR8.6 TS1.3 U20.8(OUTB)
AOUT2: HDR8.7 TS1.4 U20.9(OUTC)
AOUT3: HDR8.8 TS1.5 U20.10(OUTD)
SCL: HDR8.3 R78.1 R79.2 ; port SCL
SCL#: R78.2 U20.2(SCL) U21.5(SCL)
SDA: HDR8.4 R76.1 R77.2 ; port SDA
SDA#: R76.2 U20.5(SDA) U21.6(SDA)
VREF_AOUT: JP4.2 JP4.3 U20.6(REF)

### Notes on the sheet
- (near JP4) VREF Header
- (near HDR8) Analog GND
- I2C/Analog Extension Header
- (near HDR8) Power GND
- Title
- Size:
- Date:
- A
- Number:
- Time:
- Revision:
- Sheet
- of
- File:

### Library data of the parts
C47 C49 C54-C57 = CAP: Capacitor; Fitted: True
C48 = CAP_POLAR: Polar Capacitor; Fitted: True
HDR8 = Header 7X2: Header, 7-Pin, Dual row; Manufacturer: Generic Components; Class I: Connector; Fitted: True; Revision: July-2002: Re-released for DXP Platform.; Publisher: Altium Limited
JP4 = Header 2X2: as JP5 on sheet BOC_IO; Revision: July-2002: Re-released for DXP Platform.; Publisher: Altium Limited
R75-R80 = RES: Resistor; Fitted: True
TS1 = TS10: Screw Terminal Strip, 10 Way, 2.54 mm Pitch; Fitted: True
U20 = MAX5841: 4 Channel DAC,I2C,2.7V to 5.5V; Fitted: True
U21 = MAX1037: 4 Channel 8 Bit ADC, I2C interface, 2.7V to 3.6V Supply; Fitted: True

## Sheet BOC_CAN.SchDoc: Board-On-Chip CAN Interface
size A; Organization: Altium Limited; Address1: L3, 12a Rodborough Rd; Address2: Frenchs Forest; Address3: NSW; Address4: Australia 2086; Revision: 1.06; SheetNumber: 13; SheetTotal: 16
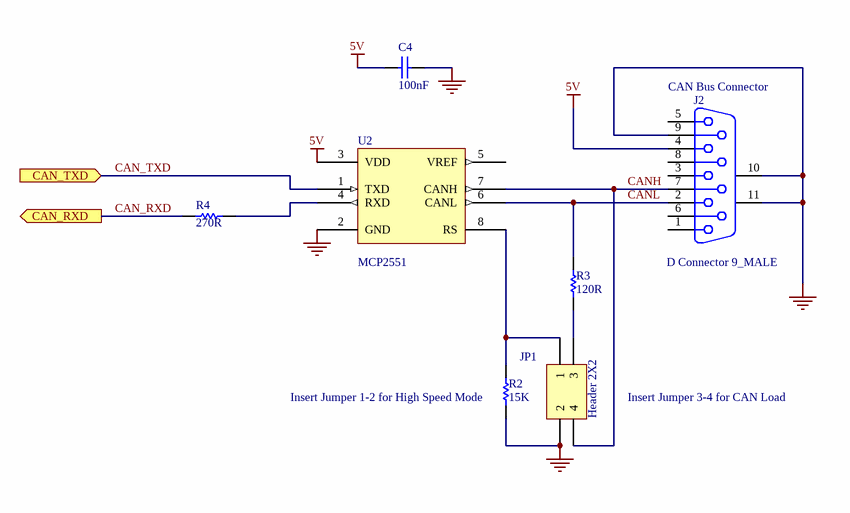
[diagram p7: BOC_CAN.SchDoc]

### Parts
C4  100nF  [CC2012-0805]
J2  D Connector 9_MALE  [DSUB1.9_MALE]
JP1  Header 2X2  [HDR2X2]
R2  15K  [CC2012-0805]
R3  120R  [CC2012-0805]
R4  270R  [CC2012-0805]
U2  MCP2551  [SOIC8]

### Ports
CAN_RXD (out), CAN_TXD (in)

### Nets
5V: C4.1 J2.4 U2.3(VDD)
GND: C4.2 J2.9 J2.10(MH1) J2.11(MH2) JP1.2 R2.1 U2.2(GND)
CAN_RXD: R4.1 ; port CAN_RXD
CAN_TXD: U2.1(TXD) ; port CAN_TXD
CANH: J2.7 JP1.4 U2.7(CANH)
CANL: J2.2 R3.2 U2.6(CANL)
NetJP1_1: JP1.1 R2.2 U2.8(RS)
NetJP1_3: JP1.3 R3.1
NetR4_2: R4.2 U2.4(RXD)

Not connected (* = marked no-connect by the designer): J2 1 3 5 6 8; U2 5(VREF)

### Notes on the sheet
- (near J2) CAN Bus Connector
- (near R2) Insert Jumper 1-2 for High Speed Mode
- Insert Jumper 3-4 for CAN Load
- Title
- Size:
- Date:
- A
- Number:
- Time:
- Revision:
- Sheet
- of
- File:

### Library data of the parts
C4 = CAP: Capacitor; Fitted: True
J2 = D Connector 9_MALE: Receptacle Assembly, 9 Position, Right Angle; Manufacturer: Generic Components; Package Information: Latest Revision: O; Positions: 9; Fitted: True; Published: 15-Jun-2001; Revision: July-2002: Re-released for DXP Platform.; Datasheet: (1-Sep-1999); Package Reference: 788750; Publisher: Altium Limited; Class I: Connector; Orientation: Right Angle; Gender: Receptacle
JP1 = Header 2X2: as JP5 on sheet BOC_IO; Revision: July-2002: Re-released for DXP Platform.; Publisher: Altium Limited
R2-R4 = RES: Resistor; Fitted: True
U2 = MCP2551: High Speed Can Transceiver; Fitted: True

## Sheet BOC_LED_DIPSWITCH.SchDoc: Board-On-Chip LEDs and DIP Switch
size A; Organization: Altium Limited; Address1: L3, 12a Rodborough Rd; Address2: Frenchs Forest; Address3: NSW; Address4: Australia 2086; Revision: 1.06; SheetNumber: 7; SheetTotal: 16
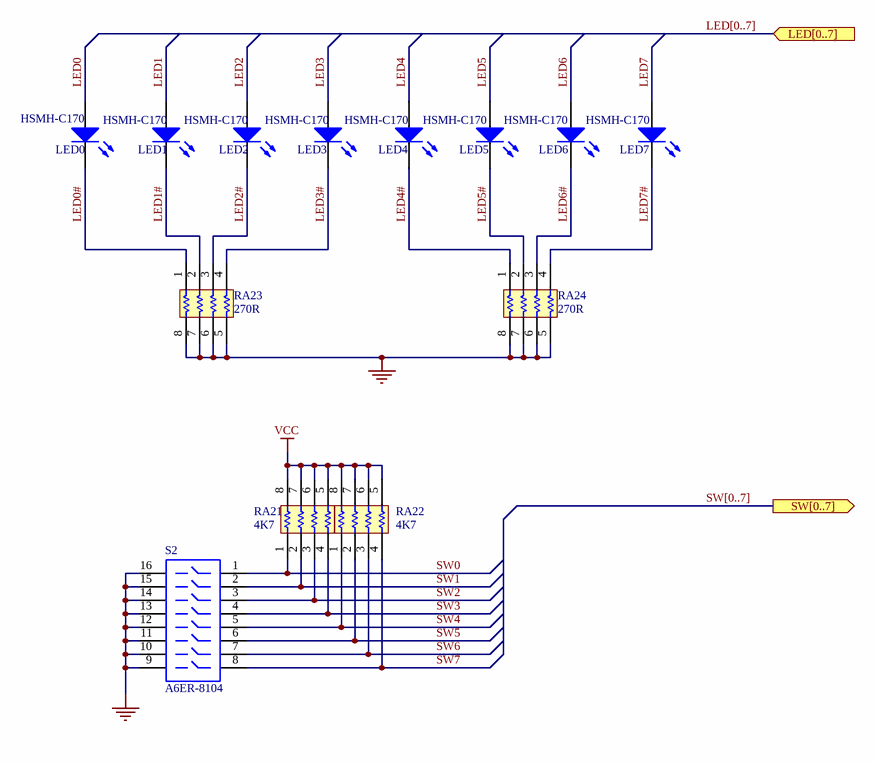
[diagram p8: BOC_LED_DIPSWITCH.SchDoc]

### Parts
LED0  HSMH-C170  [SMD _LED]
LED1  HSMH-C170  [SMD _LED]
LED2  HSMH-C170  [SMD _LED]
LED3  HSMH-C170  [SMD _LED]
LED4  HSMH-C170  [SMD _LED]
LED5  HSMH-C170  [SMD _LED]
LED6  HSMH-C170  [SMD _LED]
LED7  HSMH-C170  [SMD _LED]
RA21  4K7  [MNR34]
RA22  4K7  [MNR34]
RA23  270R  [MNR34]
RA24  270R  [MNR34]
S2  A6ER-8104  [DIP-16-KEY]

### Ports
LED[0..7] (in), SW[0..7] (out)

### Nets
GND: RA23.5 RA23.6 RA23.7 RA23.8 RA24.5 RA24.6 RA24.7 RA24.8 S2.9 S2.10 S2.11 S2.12 S2.13 S2.14 S2.15 S2.16
VCC: RA21.5 RA21.6 RA21.7 RA21.8 RA22.5 RA22.6 RA22.7 RA22.8
LED0: LED0.1(A)
LED0#: LED0.2(K) RA23.1
LED1: LED1.1(A)
LED1#: LED1.2(K) RA23.2
LED2: LED2.1(A)
LED2#: LED2.2(K) RA23.3
LED3: LED3.1(A)
LED3#: LED3.2(K) RA23.4
LED4: LED4.1(A)
LED4#: LED4.2(K) RA24.1
LED5: LED5.1(A)
LED5#: LED5.2(K) RA24.2
LED6: LED6.1(A)
LED6#: LED6.2(K) RA24.3
LED7: LED7.1(A)
LED7#: LED7.2(K) RA24.4
SW0: RA21.1 S2.1
SW1: RA21.2 S2.2
SW2: RA21.3 S2.3
SW3: RA21.4 S2.4
SW4: RA22.1 S2.5
SW5: RA22.2 S2.6
SW6: RA22.3 S2.7
SW7: RA22.4 S2.8

### Buses and harness runs
bus LED[0..7] = port LED[0..7]
bus SW[0..7] = port SW[0..7]

### Notes on the sheet
- Title
- Size:
- Date:
- A
- Number:
- Time:
- Revision:
- Sheet
- of
- File:

### Library data of the parts
LED0-LED7 = HSMX-C670: Typical RED GaAs SMD LED Agilent make; Manufacturer: Generic Components; Class I: Optoelectronic; Fitted: True; Published: 8-Jun-2000; Revision: July-2002: Re-released for DXP Platform.; Publisher: Altium Limited; Class II: LED
RA21-RA24 = MNR34: 3216x4 Resistor Array; Fitted: True
S2 = A6ER-8104: DIP Switch Side actuator long liver Piano Key; Manufacturer: Generic Components; Fitted: True; Published: 24-Mar-1999; Revision: July-2002: Re-released for DXP Platform.; Publisher: Altium Limited

## Sheet BOC_CLK_ADJ.SchDoc: Board-On-Chip System Clock
size A; Organization: Altium Limited; Address1: L3, 12a Rodborough Rd; Address2: Frenchs Forest; Address3: NSW; Address4: Australia 2086; Revision: 1.06; SheetNumber: 5; SheetTotal: 16
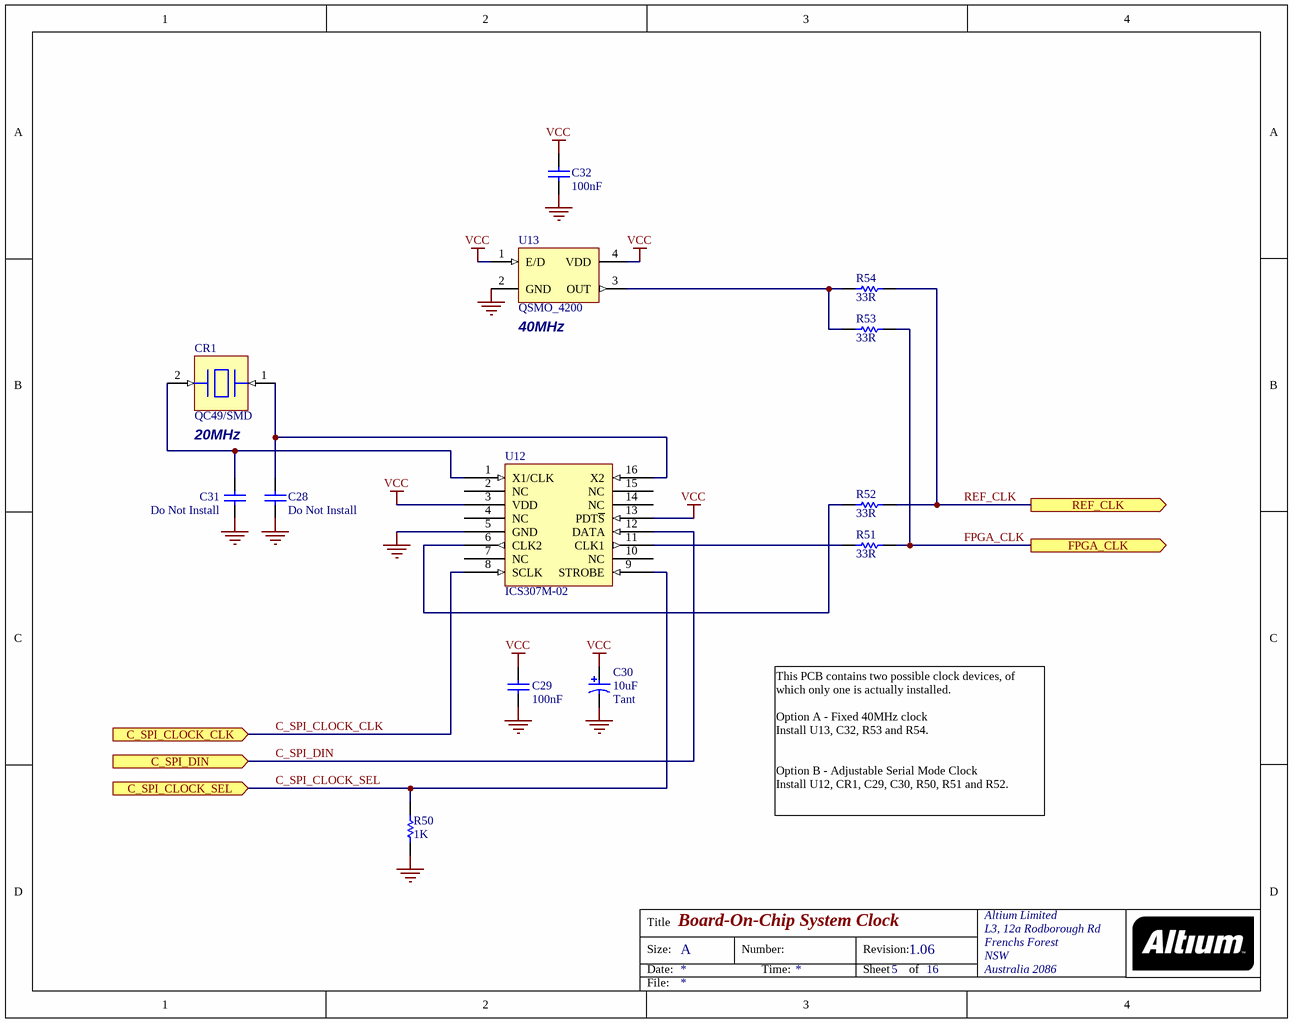
[diagram p9: BOC_CLK_ADJ.SchDoc]

### Parts
C28  Do Not Install  [CC2012-0805]
C29  100nF  [CC2012-0805]
C30  10uF  Capacitor Type: Tant  [MCCT-B]
C31  Do Not Install  [CC2012-0805]
C32  100nF  [CC2012-0805]
CR1  QC49/SMD  [QC49/SMD]
R50  1K  [CC2012-0805]
R51  33R  [CC2012-0805]
R52  33R  [CC2012-0805]
R53  33R  [CC2012-0805]
R54  33R  [CC2012-0805]
U12  ICS307M-02  [SO-G16]
U13  QSMO_4200  [QSMO_4200]

### Ports
C_SPI_CLOCK_CLK (in), C_SPI_CLOCK_SEL (in), C_SPI_DIN (in), FPGA_CLK (out), REF_CLK (out)

### Nets
GND: C28.2 C29.2 C30.2 C31.2 C32.2 R50.2 U12.5(GND) U13.2(GND)
VCC: C29.1 C30.1 C32.1 U12.3(VDD) U12.13(PDT~{S}) U13.1(E/D) U13.4(VDD)
C_SPI_CLOCK_CLK: U12.8(SCLK) ; port C_SPI_CLOCK_CLK
C_SPI_CLOCK_SEL: R50.1 U12.9(STROBE) ; port C_SPI_CLOCK_SEL
C_SPI_DIN: U12.12(DATA) ; port C_SPI_DIN
FPGA_CLK: R51.2 R53.2 ; port FPGA_CLK
REF_CLK: R52.2 R54.2 ; port REF_CLK
NetC28_1: C28.1 CR1.1 U12.16(X2)
NetC31_1: C31.1 CR1.2 U12.1(X1/CLK)
NetR51_1: R51.1 U12.11(CLK1)
NetR52_1: R52.1 U12.6(CLK2)
NetR53_1: R53.1 R54.1 U13.3(OUT)

Not connected (* = marked no-connect by the designer): U12 2(NC) 4(NC) 7(NC) 10(NC) 14(NC) 15(NC)

### Notes on the sheet
- (near U13) 40MHz
- 20MHz
- This PCB contains two possible clock devices, of which only one is actually installed.
  Option A - Fixed 40MHz clock
  Install U13, C32, R53 and R54.
  Option B - Adjustable Serial Mode Clock
  Install U12, CR1, C29, C30, R50, R51 and R52.
- Title
- Size:
- Date:
- A
- Number:
- Time:
- Revision:
- Sheet
- of
- File:

### Library data of the parts
C28 C31 C32 = CAP: Capacitor; Fitted: False
C29 = CAP: Capacitor; Fitted: True
C30 = CAP_POLAR: Polar Capacitor; Fitted: True
CR1 = QC49/SMD: SMD Crystal 20MHz HY-Q; Fitted: True; C-MAC Watch Crystal: *; Farnel/RS-316-0312: *; 4.13$: *; C-MAC/FOX: *; Future: *
R50-R52 = RES: Resistor; Fitted: True
R53 R54 = RES: Resistor; Fitted: False
U12 = ICS307-02: Serial Programmable PLL Oscillator; Fitted: True
U13 = QSMO_4200: Surface Mount Crystal Oscillator; Fitted: False

## Sheet BOC_LCD.SchDoc: Board-On-Chip LCD Display
size A; Organization: Altium Limited; Address1: L3, 12a Rodborough Rd; Address2: Frenchs Forest; Address3: NSW; Address4: Australia 2086; Revision: 1.06; SheetNumber: 10; SheetTotal: 16
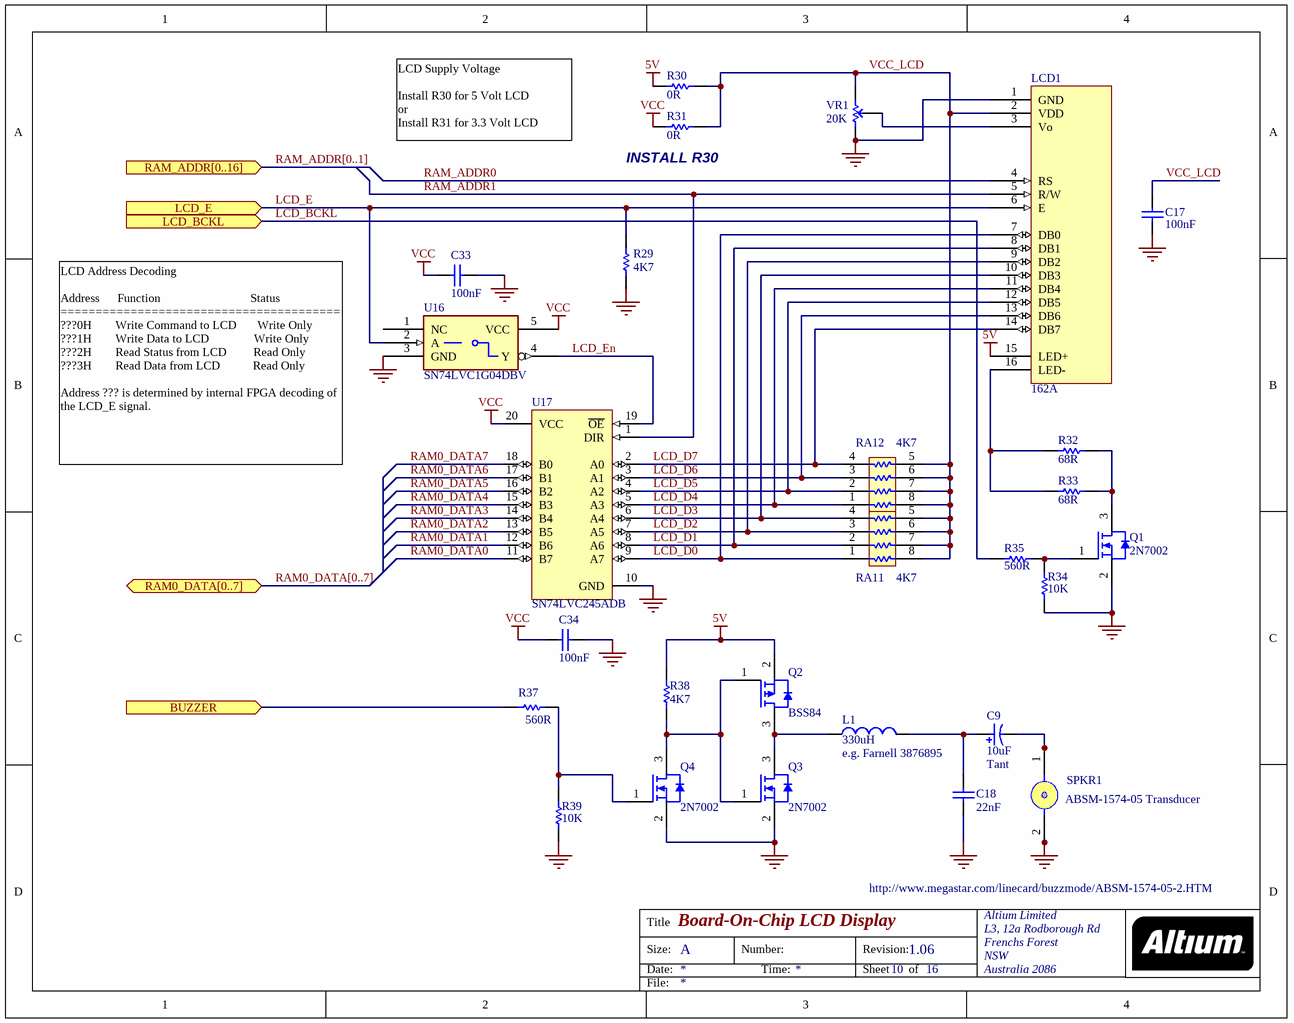
[diagram p10: BOC_LCD.SchDoc]

### Parts
C9  10uF  Capacitor Type: Tant  [MCCT-B]
C17  100nF  [CC2012-0805]
C18  22nF  [CC2012-0805]
C33  100nF  [CC2012-0805]
C34  100nF  [CC2012-0805]
L1  330uH  Part No: e.g. Farnell 3876895  [CC4532-1812]
LCD1  162A  [162A]
Q1  2N7002  [SO-G3]
Q2  BSS84  [SO-G3]
Q3  2N7002  [SO-G3]
Q4  2N7002  [SO-G3]
R29  4K7  [CC2012-0805]
R30  0R  [CC2012-0805]
R31  0R  [CC2012-0805]
R32  68R  [CC2012-0805]
R33  68R  [CC2012-0805]
R34  10K  [CC2012-0805]
R35  560R  [CC2012-0805]
R37  560R  [CC2012-0805]
R38  4K7  [CC2012-0805]
R39  10K  [CC2012-0805]
RA11  4K7  [MNR34]
RA12  4K7  [MNR34]
SPKR1  ABSM-1574-05 Transducer  [ABSM-1574]
U16  SN74LVC1G04DBV  [SO-G5/P.95]
U17  SN74LVC245ADB  [SSO-G20/P.65]
VR1  20K  [POT4MM-2]

### Ports
BUZZER (in), LCD_BCKL (in), LCD_E (in), RAM0_DATA[0..7] (bidir), RAM_ADDR[0..16] (in)

### Nets
5V: LCD1.15(LED+) Q2.2 R30.1 R38.1
GND: C17.2 C18.2 C33.2 C34.2 LCD1.1(GND) Q1.2 Q3.2 Q4.2 R29.2 R34.1 R39.2 SPKR1.2 SPKR1.2A U16.3(GND) U17.10(GND) VR1.CCW(-)
VCC: C33.1 C34.1 R31.1 U16.5(VCC) U17.20(VCC)
BUZZER: R37.1 ; port BUZZER
LCD_BCKL: R35.1 ; port LCD_BCKL
LCD_D0: LCD1.7(DB0) RA11.1 U17.9(A7)
LCD_D1: LCD1.8(DB1) RA11.2 U17.8(A6)
LCD_D2: LCD1.9(DB2) RA11.3 U17.7(A5)
LCD_D3: LCD1.10(DB3) RA11.4 U17.6(A4)
LCD_D4: LCD1.11(DB4) RA12.1 U17.5(A3)
LCD_D5: LCD1.12(DB5) RA12.2 U17.4(A2)
LCD_D6: LCD1.13(DB6) RA12.3 U17.3(A1)
LCD_D7: LCD1.14(DB7) RA12.4 U17.2(A0)
LCD_E: LCD1.6(E) R29.1 U16.2(A) ; port LCD_E
LCD_En: U16.4(Y) U17.19(~{OE})
RAM0_DATA0: U17.11(B7)
RAM0_DATA1: U17.12(B6)
RAM0_DATA2: U17.13(B5)
RAM0_DATA3: U17.14(B4)
RAM0_DATA4: U17.15(B3)
RAM0_DATA5: U17.16(B2)
RAM0_DATA6: U17.17(B1)
RAM0_DATA7: U17.18(B0)
RAM_ADDR0: LCD1.4(RS)
RAM_ADDR1: LCD1.5(R/W) U17.1(DIR)
VCC_LCD: C17.1 LCD1.2(VDD) R30.2 R31.2 RA11.5 RA11.6 RA11.7 RA11.8 RA12.5 RA12.6 RA12.7 RA12.8 VR1.CW(+)
NetC9_1: C9.1 C18.1 L1.2
NetC9_2: C9.2 SPKR1.1 SPKR1.1A
NetL1_1: L1.1 Q2.3 Q3.3
NetLCD1_3: LCD1.3(Vo) VR1.W
NetLCD1_16: LCD1.16(LED-) R32.1 R33.1
NetQ1_1: Q1.1 R34.2 R35.2
NetQ1_3: Q1.3 R32.2 R33.2
NetQ2_1: Q2.1 Q3.1 Q4.3 R38.2
NetQ4_1: Q4.1 R37.2 R39.1

Not connected (* = marked no-connect by the designer): U16 1(NC)

### Buses and harness runs
bus RAM0_DATA[0..7] = port RAM0_DATA[0..7]
bus RAM_ADDR[0..1] = port RAM_ADDR[0..16]

### Notes on the sheet
- LCD Supply Voltage
  Install R30 for 5 Volt LCD
  or
  Install R31 for 3.3 Volt LCD
- (near R31) INSTALL R30
- LCD Address Decoding
  Address      Function                              Status
  ========================================
  ???0H        Write Command to LCD       Write Only
  ???1H        Write Data to LCD               Write Only
  ???2H        Read Status from LCD         Read Only
  ???3H        Read Data from LCD           Read Only
  Address ??? is determined by internal FPGA decoding of the LCD_E signal.
- Title
- Size:
- Date:
- A
- Number:
- Time:
- Revision:
- Sheet
- of
- File:

### Library data of the parts
C9 = CAP_POLAR: Polar Capacitor; Fitted: True
C17 C18 C33 C34 = CAP: Capacitor; Fitted: True
L1 = INDUCTOR: Inductor e.g. Farnell 3876895; Fitted: True
LCD1 = 162A: 16 char * 2 line LCD character display with b/light; Fitted: True
Q1 Q3 Q4 = 2N7002: N Channel Mosfet; Fitted: True
Q2 = BSS84: P Channel Mosfet; Fitted: True
R29 R30 R32-R35 R37-R39 = RES: Resistor; Fitted: True
R31 = RES: Resistor; Fitted: False
RA11 RA12 = MNR34: 3216x4 Resistor Array; Fitted: True
SPKR1 = ABSM-1574-05 Transducer: Megastar Subminiature Transducer; Fitted: True; Web: http://www.megastar.com/linecard/buzzmode/ABSM-1574-05-2.HTM
U16 = SN74AHC1G04DBVR: Manufacturer: TI; Fitted: True
U17 = 74LVC245A: Octal Bus Transceiver with 3-State Outputs; Manufacturer: Texas Instruments; Revision 1: 12-July-2000: SIM Model Added.; Revision 2: July-2002: Re-released for DXP Platform.; Class I: Interface; Class II: Line Transceiver; Fitted: True; Published: 8-Jun-2000; Datasheet: Latest Revision: Oct-1993; Package Reference: J020; Publisher: Altium Limited
VR1 = POT_M: Potentiometer; Fitted: True

## Sheet BOC_VGA_KB_MOUSE.SchDoc: Board-On-Chip VGA, KB, and Mouse
size A; Organization: Altium Limited; Address1: L3, 12a Rodborough Rd; Address2: Frenchs Forest; Address3: NSW; Address4: Australia 2086; Revision: 1.06; SheetNumber: 15; SheetTotal: 16
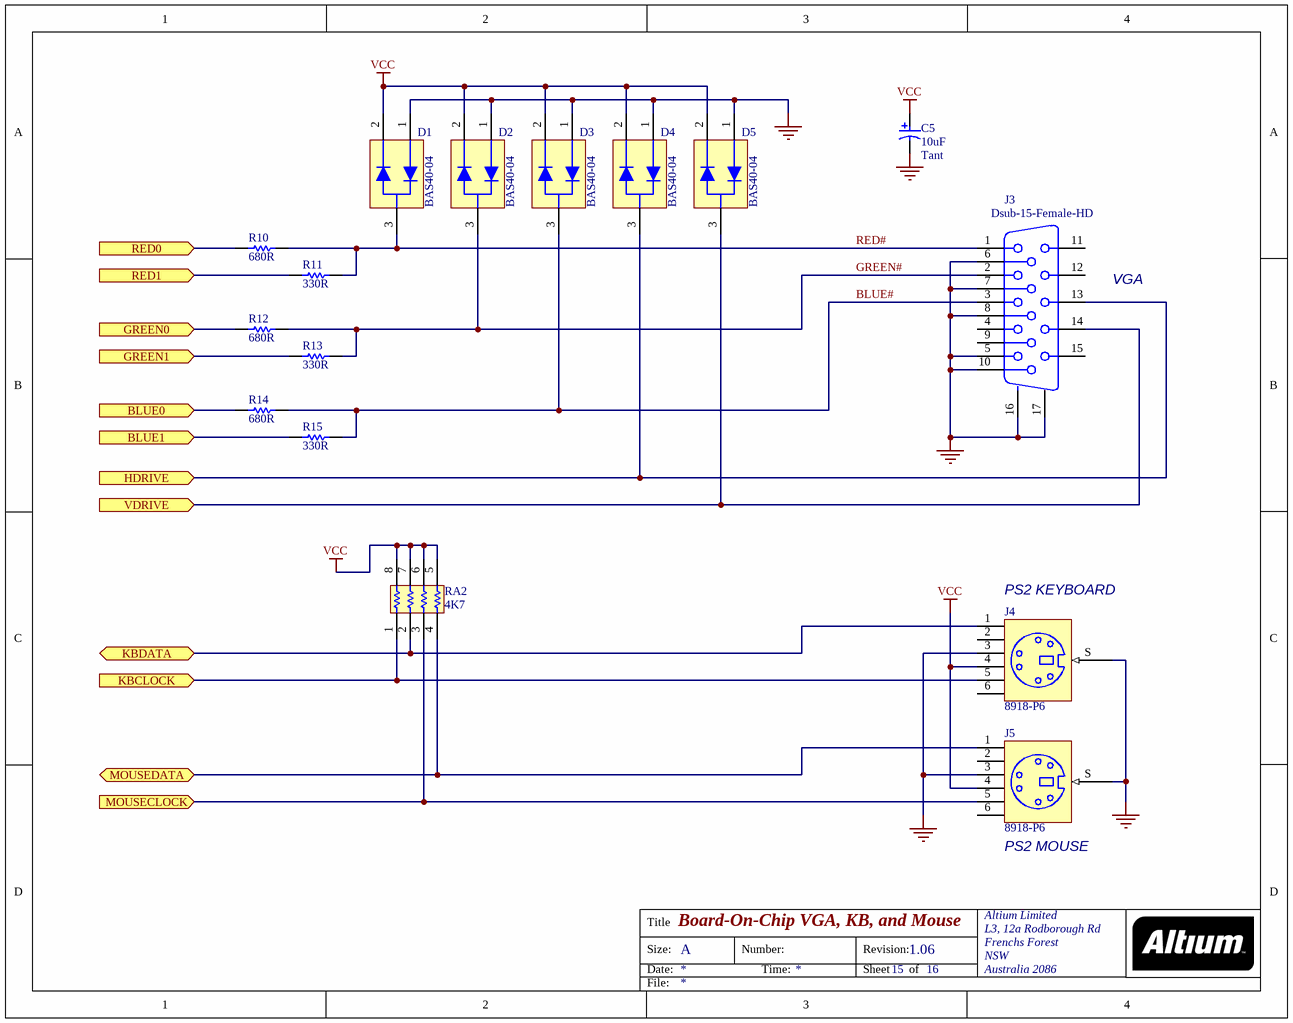
[diagram p11: BOC_VGA_KB_MOUSE.SchDoc]

### Parts
C5  10uF  Capacitor Type: Tant  [MCCT-B]
D1  BAS40-04  [SO-G3]
D2  BAS40-04  [SO-G3]
D3  BAS40-04  [SO-G3]
D4  BAS40-04  [SO-G3]
D5  BAS40-04  [SO-G3]
J3  Dsub-15-Female-HD  [DB15-VGA-Female]
J4  8918-P6  [PS2-6PIN]
J5  8918-P6  [PS2-6PIN]
R10  680R  [CC2012-0805]
R11  330R  [CC2012-0805]
R12  680R  [CC2012-0805]
R13  330R  [CC2012-0805]
R14  680R  [CC2012-0805]
R15  330R  [CC2012-0805]
RA2  4K7  [MNR34]

### Ports
BLUE0 (in), BLUE1 (in), GREEN0 (in), GREEN1 (in), HDRIVE (in), KBCLOCK (in), KBDATA (bidir), MOUSECLOCK (in), MOUSEDATA (bidir), RED0 (in), RED1 (in), VDRIVE (in)

### Nets
GND: C5.2 D1.1 D2.1 D3.1 D4.1 D5.1 J3.5 J3.6 J3.7 J3.8 J3.10 J3.16(MH1) J3.17(MH2) J4.3 J4.S J5.3 J5.S
VCC: C5.1 D1.2 D2.2 D3.2 D4.2 D5.2 J4.4 J5.4 RA2.5 RA2.6 RA2.7 RA2.8
BLUE0: R14.1 ; port BLUE0
BLUE1: R15.1 ; port BLUE1
BLUE#: D3.3 J3.3 R14.2 R15.2
GREEN0: R12.1 ; port GREEN0
GREEN1: R13.1 ; port GREEN1
GREEN#: D2.3 J3.2 R12.2 R13.2
HDRIVE: D4.3 J3.13 ; port HDRIVE
KBCLOCK: J4.5 RA2.1 ; port KBCLOCK
KBDATA: J4.1 RA2.2 ; port KBDATA
MOUSECLOCK: J5.5 RA2.3 ; port MOUSECLOCK
MOUSEDATA: J5.1 RA2.4 ; port MOUSEDATA
RED0: R10.1 ; port RED0
RED1: R11.1 ; port RED1
RED#: D1.3 J3.1 R10.2 R11.2
VDRIVE: D5.3 J3.14 ; port VDRIVE

Not connected (* = marked no-connect by the designer): J3 4 9 11 12 15; J4 2 6; J5 2 6

### Notes on the sheet
- VGA
- (near J4) PS2 KEYBOARD
- (near J5) PS2 MOUSE
- Title
- Size:
- Date:
- A
- Number:
- Time:
- Revision:
- Sheet
- of
- File:

### Library data of the parts
C5 = CAP_POLAR: Polar Capacitor; Fitted: True; Supplier: FARNELL; Supplier Code: 967-117
D1-D5 = BAS40-04: Shottky Diode Pair; Fitted: True
J3 = Dsub-15-Female-HD: Dsub-15 High density VGA Female connetor; Manufacturer: Generic Components; Package Information: Latest Revision: E; Class I: Connector; Positions: 30; Gender: Receptacle Header; Fitted: True; Published: 15-Jun-2001; Revision: July-2002: Re-released for DXP Platform.; Datasheet: (31-Oct-1991); Package Reference: 174213; Publisher: Altium Limited; Orientation: Right Angle
J4 J5 = PS2-6PIN: 6 Pin Through Hole PS2 Socket (Kycon P/N); Fitted: True; Webpdf: http://www.kycon.com/Pub_Eng_Draw/KFMDG-xS-BSC.pdf
R10-R15 = RES: Resistor; Fitted: True
RA2 = MNR34: 3216x4 Resistor Array; Fitted: True

## Sheet BOC_Spartan.SchDoc: Board-On-Chip Programmable Logic
size C; Organization: Altium Limited; Address1: L3, 12a Rodborough Rd; Address2: Frenchs Forest; Address3: NSW; Address4: Australia 2086; Revision: 1.06; SheetNumber: 4; SheetTotal: 16
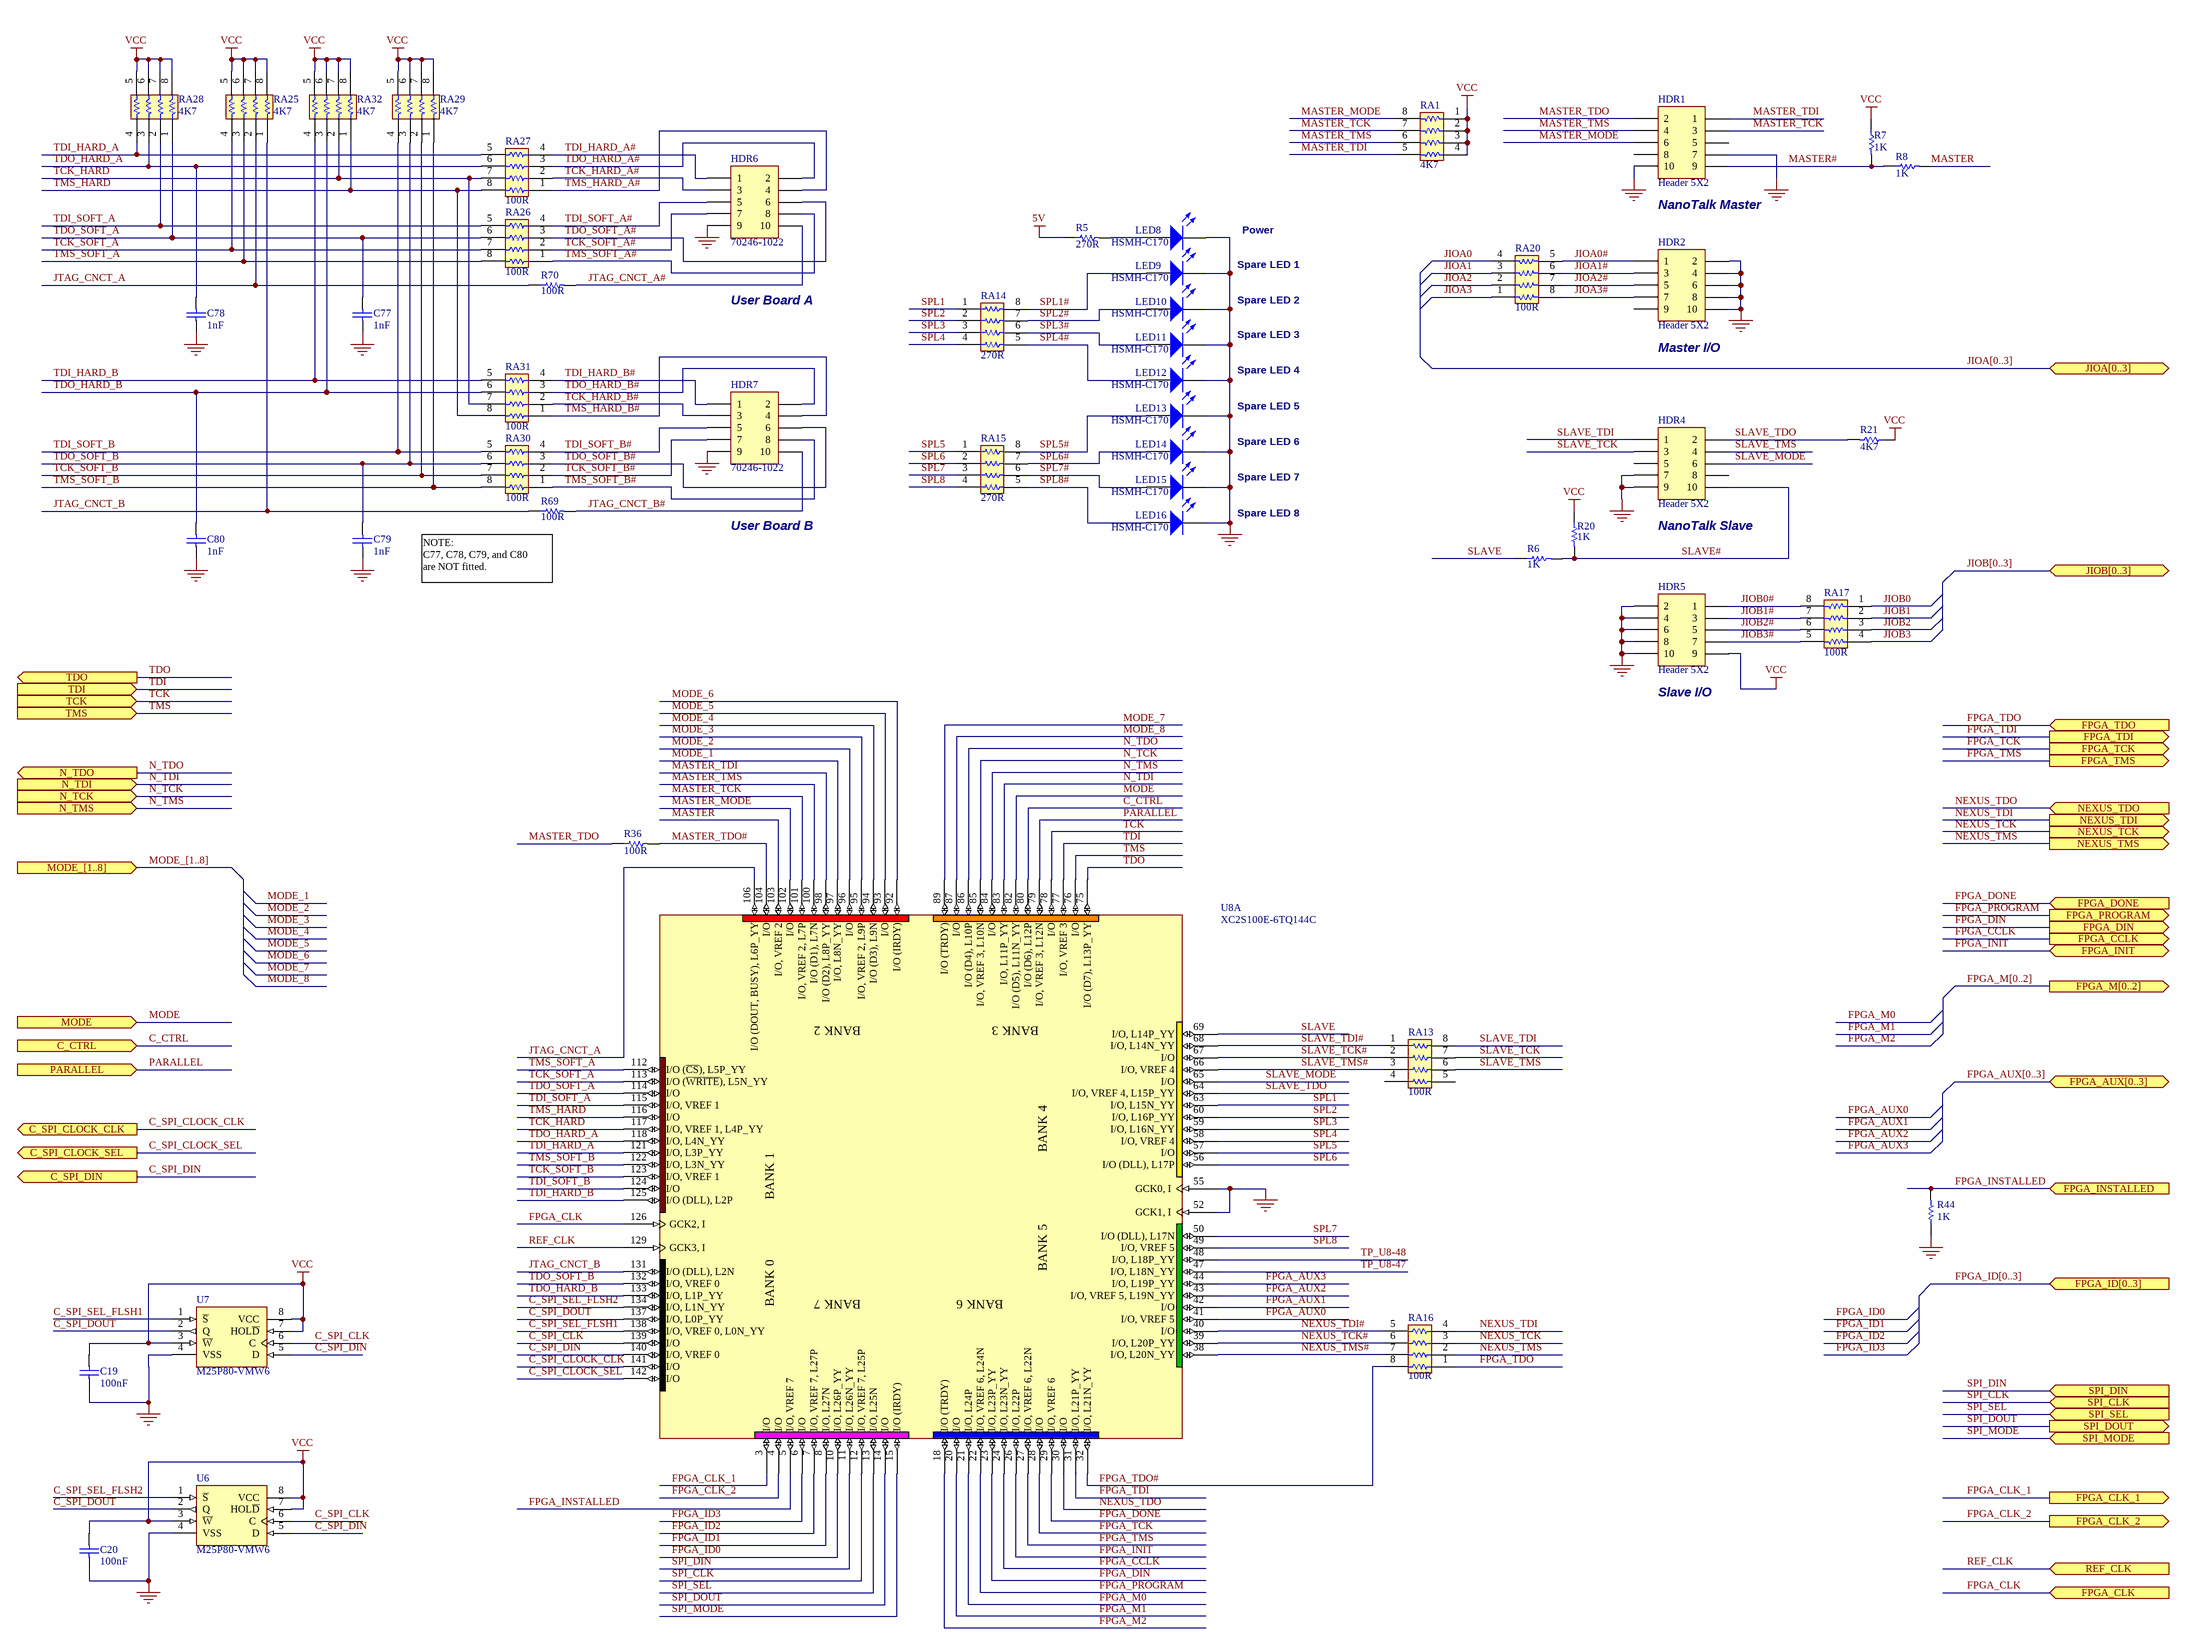
[diagram p12: BOC_Spartan.SchDoc]

### Parts
C19  100nF  [CC2012-0805]
C20  100nF  [CC2012-0805]
C77  1nF  [CC2012-0805]
C78  1nF  [CC2012-0805]
C79  1nF  [CC2012-0805]
C80  1nF  [CC2012-0805]
HDR1  Header 5X2  Usage: NanoTalk Master  [HDR2X5]
HDR2  Header 5X2  Usage: Master I/O  [HDR2X5]
HDR4  Header 5X2  Usage: NanoTalk Slave  [HDR2X5]
HDR5  Header 5X2  Usage: Slave I/O  [HDR2X5]
HDR6  70246-1022  Usage: User Board A  [HDR2X5_LP]
HDR7  70246-1022  Usage: User Board B  [HDR2X5_LP]
LED8  HSMH-C170  [SMD _LED]
LED9  HSMH-C170  [SMD _LED]
LED10  HSMH-C170  [SMD _LED]
LED11  HSMH-C170  [SMD _LED]
LED12  HSMH-C170  [SMD _LED]
LED13  HSMH-C170  [SMD _LED]
LED14  HSMH-C170  [SMD _LED]
LED15  HSMH-C170  [SMD _LED]
LED16  HSMH-C170  [SMD _LED]
R5  270R  [CC2012-0805]
R6  1K  [CC2012-0805]
R7  1K  [CC2012-0805]
R8  1K  [CC2012-0805]
R20  1K  [CC2012-0805]
R21  4K7  [CC2012-0805]
R36  100R  [CC2012-0805]
R44  1K  [CC2012-0805]
R69  100R  [CC2012-0805]
R70  100R  [CC2012-0805]
RA1  4K7  [MNR34]
RA13  100R  [MNR34]
RA14  270R  [MNR34]
RA15  270R  [MNR34]
RA16  100R  [MNR34]
RA17  100R  [MNR34]
RA20  100R  [MNR34]
RA25  4K7  [MNR34]
RA26  100R  [MNR34]
RA27  100R  [MNR34]
RA28  4K7  [MNR34]
RA29  4K7  [MNR34]
RA30  100R  [MNR34]
RA31  100R  [MNR34]
RA32  4K7  [MNR34]
U6  M25P80-VMW6  [SO8_MW/SO8_MN]
U7  M25P80-VMW6  [SO8_MW/SO8_MN]
U8  XC2S100E-6TQ144C  [TQ144]  (part A of 3)

### Ports
C_CTRL (in), C_SPI_CLOCK_CLK (out), C_SPI_CLOCK_SEL (out), C_SPI_DIN (out), FPGA_AUX[0..3] (bidir), FPGA_CCLK (out), FPGA_CLK (in), FPGA_CLK_1 (out), FPGA_CLK_2 (out), FPGA_DIN (out), FPGA_DONE (in), FPGA_ID[0..3] (in), FPGA_INIT (bidir), FPGA_INSTALLED (in), FPGA_M[0..2] (out), FPGA_PROGRAM (out), FPGA_TCK (out), FPGA_TDI (out), FPGA_TDO (in), FPGA_TMS (out), JIOA[0..3] (bidir), JIOB[0..3] (bidir), MODE (in), MODE_[1..8] (in), N_TCK (in), N_TDI (in), N_TDO (out), N_TMS (in), NEXUS_TCK (out), NEXUS_TDI (out), NEXUS_TDO (in), NEXUS_TMS (out), PARALLEL (in), REF_CLK (in), SPI_CLK (in), SPI_DIN (in), SPI_DOUT (out), SPI_MODE (in), SPI_SEL (in), TCK (in), TDI (in), TDO (out), TMS (in)

### Nets
5V: R5.1
GND: C19.1 C20.2 C77.2 C78.2 C79.2 C80.2 HDR1.7 HDR1.10 HDR2.2 HDR2.4 HDR2.6 HDR2.8 HDR2.10 HDR4.7 HDR4.9 HDR5.2 HDR5.4 HDR5.6 HDR5.8 HDR5.10 HDR6.9 HDR7.9 LED8.2(K) LED9.2(K) LED10.2(K) LED11.2(K) LED12.2(K) LED13.2(K) LED14.2(K) LED15.2(K) LED16.2(K) R44.1 U6.4(VSS) U7.4(VSS) U8.52(GCK1,_I) U8.55(GCK0,_I)
VCC: C19.2 C20.1 HDR5.9 R7.1 R20.1 R21.1 RA1.1 RA1.2 RA1.3 RA1.4 RA25.5 RA25.6 RA25.7 RA25.8 RA28.5 RA28.6 RA28.7 RA28.8 RA29.5 RA29.6 RA29.7 RA29.8 RA32.5 RA32.6 RA32.7 RA32.8 U6.3(~{W}) U6.7(HOL~{D}) U6.8(VCC) U7.3(~{W}) U7.7(HOL~{D}) U7.8(VCC)
C_CTRL: U8.80(I/O_(D6),_L12P) ; port C_CTRL
C_SPI_CLK: U6.6(C) U7.6(C) U8.139(I/O)
C_SPI_CLOCK_CLK: U8.141(I/O) ; port C_SPI_CLOCK_CLK
C_SPI_CLOCK_SEL: U8.142(I/O) ; port C_SPI_CLOCK_SEL
C_SPI_DIN: U6.5(D) U7.5(D) U8.140(I/O,_VREF_0) ; port C_SPI_DIN
C_SPI_DOUT: U6.2(Q) U7.2(Q) U8.137(I/O,_L0P_YY)
C_SPI_SEL_FLSH1: U7.1(~{S}) U8.138(I/O,_VREF_0,_L0N_YY)
C_SPI_SEL_FLSH2: U6.1(~{S}) U8.134(I/O,_L1N_YY)
FPGA_AUX0: U8.41(I/O,_VREF_5)
FPGA_AUX1: U8.42(I/O)
FPGA_AUX2: U8.43(I/O,_VREF_5,_L19N_YY)
FPGA_AUX3: U8.44(I/O,_L19P_YY)
FPGA_CCLK: U8.24(I/O,_L23N_YY) ; port FPGA_CCLK
FPGA_CLK: U8.126(GCK2,_I) ; port FPGA_CLK
FPGA_CLK_1: U8.3(I/O) ; port FPGA_CLK_1
FPGA_CLK_2: U8.4(I/O) ; port FPGA_CLK_2
FPGA_DIN: U8.23(I/O,_L23P_YY) ; port FPGA_DIN
FPGA_DONE: U8.29(I/O,_VREF_6) ; port FPGA_DONE
FPGA_ID0: U8.10(I/O,_L26P_YY)
FPGA_ID1: U8.8(I/O,_L27N)
FPGA_ID2: U8.7(I/O,_VREF_7,_L27P)
FPGA_ID3: U8.6(I/O)
FPGA_INIT: U8.26(I/O,_L22P) ; port FPGA_INIT
FPGA_INSTALLED: R44.2 U8.5(I/O,_VREF_7) ; port FPGA_INSTALLED
FPGA_M0: U8.21(I/O,_L24P)
FPGA_M1: U8.20(I/O)
FPGA_M2: U8.18(I/O_(TRDY))
FPGA_PROGRAM: U8.22(I/O,_VREF_6,_L24N) ; port FPGA_PROGRAM
FPGA_TCK: U8.28(I/O) ; port FPGA_TCK
FPGA_TDI: U8.31(I/O,_L21P_YY) ; port FPGA_TDI
FPGA_TDO: RA16.1 ; port FPGA_TDO
FPGA_TDO#: RA16.8 U8.32(I/O,_L21N_YY)
FPGA_TMS: U8.27(I/O,_VREF_6,_L22N) ; port FPGA_TMS
JIOA0: RA20.4
JIOA0#: HDR2.1 RA20.5
JIOA1: RA20.3
JIOA1#: HDR2.3 RA20.6
JIOA2: RA20.2
JIOA2#: HDR2.5 RA20.7
JIOA3: RA20.1
JIOA3#: HDR2.7 RA20.8
JIOB0: RA17.1
JIOB0#: HDR5.1 RA17.8
JIOB1: RA17.2
JIOB1#: HDR5.3 RA17.7
JIOB2: RA17.3
JIOB2#: HDR5.5 RA17.6
JIOB3: RA17.4
JIOB3#: HDR5.7 RA17.5
JTAG_CNCT_A: R70.1 RA25.2 U8.106(I/O_(DOUT,_BUSY),_L6P_YY)
JTAG_CNCT_A#: HDR6.10 R70.2
JTAG_CNCT_B: R69.1 RA25.1 U8.131(I/O_(DLL),_L2N)
JTAG_CNCT_B#: HDR7.10 R69.2
MASTER: R8.2 U8.103(I/O,_VREF_2)
MASTER#: HDR1.9 R7.2 R8.1
MASTER_MODE: HDR1.6 RA1.8 U8.102(I/O)
MASTER_TCK: HDR1.3 RA1.7 U8.101(I/O,_VREF_2,_L7P)
MASTER_TDI: HDR1.1 RA1.5 U8.98(I/O_(D2),_L8P_YY)
MASTER_TDO: HDR1.2 R36.1
MASTER_TDO#: R36.2 U8.104(I/O)
MASTER_TMS: HDR1.4 RA1.6 U8.100(I/O_(D1),_L7N)
MODE: U8.82(I/O_(D5),_L11N_YY) ; port MODE
MODE_1: U8.97(I/O,_L8N_YY)
MODE_2: U8.96(I/O)
MODE_3: U8.95(I/O,_VREF_2,_L9P)
MODE_4: U8.94(I/O_(D3),_L9N)
MODE_5: U8.93(I/O)
MODE_6: U8.92(I/O_(IRDY))
MODE_7: U8.89(I/O_(TRDY))
MODE_8: U8.87(I/O)
N_TCK: U8.85(I/O,_VREF_3,_L10N) ; port N_TCK
N_TDI: U8.83(I/O,_L11P_YY) ; port N_TDI
N_TDO: U8.86(I/O_(D4),_L10P) ; port N_TDO
N_TMS: U8.84(I/O) ; port N_TMS
NEXUS_TCK: RA16.3 ; port NEXUS_TCK
NEXUS_TCK#: RA16.6 U8.39(I/O,_L20P_YY)
NEXUS_TDI: RA16.4 ; port NEXUS_TDI
NEXUS_TDI#: RA16.5 U8.40(I/O)
NEXUS_TDO: U8.30(I/O) ; port NEXUS_TDO
NEXUS_TMS: RA16.2 ; port NEXUS_TMS
NEXUS_TMS#: RA16.7 U8.38(I/O,_L20N_YY)
PARALLEL: U8.79(I/O,_VREF_3,_L12N) ; port PARALLEL
REF_CLK: U8.129(GCK3,_I) ; port REF_CLK
SLAVE: R6.1 U8.69(I/O,_L14P_YY)
SLAVE#: HDR4.10 R6.2 R20.2
SLAVE_MODE: HDR4.6 U8.65(I/O)
SLAVE_TCK: HDR4.3 RA13.7
SLAVE_TCK#: RA13.2 U8.67(I/O)
SLAVE_TDI: HDR4.1 RA13.8
SLAVE_TDI#: RA13.1 U8.68(I/O,_L14N_YY)
SLAVE_TDO: HDR4.2 R21.2 U8.64(I/O,_VREF_4,_L15P_YY)
SLAVE_TMS: HDR4.4 RA13.6
SLAVE_TMS#: RA13.3 U8.66(I/O,_VREF_4)
SPI_CLK: U8.12(I/O,_VREF_7,_L25P) ; port SPI_CLK
SPI_DIN: U8.11(I/O,_L26N_YY) ; port SPI_DIN
SPI_DOUT: U8.14(I/O) ; port SPI_DOUT
SPI_MODE: U8.15(I/O_(IRDY)) ; port SPI_MODE
SPI_SEL: U8.13(I/O,_L25N) ; port SPI_SEL
SPL1: RA14.1 U8.63(I/O,_L15N_YY)
SPL1#: LED9.1(A) RA14.8
SPL2: RA14.2 U8.60(I/O,_L16P_YY)
SPL2#: LED10.1(A) RA14.7
SPL3: RA14.3 U8.59(I/O,_L16N_YY)
SPL3#: LED11.1(A) RA14.6
SPL4: RA14.4 U8.58(I/O,_VREF_4)
SPL4#: LED12.1(A) RA14.5
SPL5: RA15.1 U8.57(I/O)
SPL5#: LED13.1(A) RA15.8
SPL6: RA15.2 U8.56(I/O_(DLL),_L17P)
SPL6#: LED14.1(A) RA15.7
SPL7: RA15.3 U8.50(I/O_(DLL),_L17N)
SPL7#: LED15.1(A) RA15.6
SPL8: RA15.4 U8.49(I/O,_VREF_5)
SPL8#: LED16.1(A) RA15.5
TCK: U8.78(I/O) ; port TCK
TCK_HARD: RA27.7 RA31.7 RA32.2 U8.117(I/O,_VREF_1,_L4P_YY)
TCK_HARD_A#: HDR6.3 RA27.2
TCK_HARD_B#: HDR7.3 RA31.2
TCK_SOFT_A: RA25.4 RA26.7 U8.113(I/O_(~{WRITE}),_L5N_YY)
TCK_SOFT_A#: HDR6.7 RA26.2
TCK_SOFT_B: RA29.2 RA30.7 U8.123(I/O,_VREF_1)
TCK_SOFT_B#: HDR7.7 RA30.2
TDI: U8.77(I/O,_VREF_3) ; port TDI
TDI_HARD_A: RA27.5 RA28.4 U8.121(I/O,_L3P_YY)
TDI_HARD_A#: HDR6.1 RA27.4
TDI_HARD_B: RA31.5 RA32.4 U8.125(I/O_(DLL),_L2P)
TDI_HARD_B#: HDR7.1 RA31.4
TDI_SOFT_A: RA26.5 RA28.2 U8.115(I/O,_VREF_1)
TDI_SOFT_A#: HDR6.5 RA26.4
TDI_SOFT_B: RA29.4 RA30.5 U8.124(I/O)
TDI_SOFT_B#: HDR7.5 RA30.4
TDO: U8.75(I/O_(D7),_L13P_YY) ; port TDO
TDO_HARD_A: C78.1 RA27.6 RA28.3 U8.118(I/O,_L4N_YY)
TDO_HARD_A#: HDR6.2 RA27.3
TDO_HARD_B: C80.1 RA31.6 RA32.3 U8.133(I/O,_L1P_YY)
TDO_HARD_B#: HDR7.2 RA31.3
TDO_SOFT_A: C77.1 RA26.6 RA28.1 U8.114(I/O)
TDO_SOFT_A#: HDR6.6 RA26.3
TDO_SOFT_B: C79.1 RA29.3 RA30.6 U8.132(I/O,_VREF_0)
TDO_SOFT_B#: HDR7.6 RA30.3
TMS: U8.76(I/O) ; port TMS
TMS_HARD: RA27.8 RA31.8 RA32.1 U8.116(I/O)
TMS_HARD_A#: HDR6.4 RA27.1
TMS_HARD_B#: HDR7.4 RA31.1
TMS_SOFT_A: RA25.3 RA26.8 U8.112(I/O_(~{CS}),_L5P_YY)
TMS_SOFT_A#: HDR6.8 RA26.1
TMS_SOFT_B: RA29.1 RA30.8 U8.122(I/O,_L3N_YY)
TMS_SOFT_B#: HDR7.8 RA30.1
TP_U8-47: U8.47(I/O,_L18N_YY)
TP_U8-48: U8.48(I/O,_L18P_YY)
NetLED8_1: LED8.1(A) R5.2

Not connected (* = marked no-connect by the designer): HDR1 5 8; HDR2 9; HDR4 5 8; RA13 4 5

### Buses and harness runs
bus FPGA_AUX[0..3] = port FPGA_AUX[0..3]
bus FPGA_ID[0..3] = port FPGA_ID[0..3]
bus FPGA_M[0..2] = port FPGA_M[0..2]
bus JIOA[0..3] = port JIOA[0..3]
bus JIOB[0..3] = port JIOB[0..3]
bus MODE_[1..8] = port MODE_[1..8]

### Notes on the sheet
- Spare LED 1
- Power
- Spare LED 2
- Spare LED 3
- Spare LED 4
- Spare LED 5
- Spare LED 6
- Spare LED 7
- Spare LED 8
- (near R69) NOTE:
  C77, C78, C79, and C80
  are NOT fitted.
- Title
- Size:
- Date:
- File:
- C
- Number:
- Time:
- Revision:
- Sheet
- of
- (in symbol XC2S100E-6TQ144C, part A) BANK 2; BANK 3; BANK 4; BANK 1; BANK 5; BANK 7; BANK 6; BANK 0

### Library data of the parts
C19 C20 = CAP: Capacitor; Fitted: True
C77-C80 = CAP: Capacitor; Fitted: False
HDR1 HDR2 HDR4 HDR5 = Header 5X2: Header, 5-Pin, Dual row; Manufacturer: Generic Components; Class I: Connector; Fitted: True; Revision: July-2002: Re-released for DXP Platform.; Publisher: Altium Limited
HDR6 HDR7 = Header 5X2: Header, 5-Pin, Dual row; Manufacturer: Molex; Class I: Connector; Fitted: True; Revision: July-2002: Re-released for DXP Platform.; Publisher: Altium Limited
LED8-LED16 = HSMX-C670: as LED0 on sheet BOC_LED_DIPSWITCH; Published: 8-Jun-2000; Revision: July-2002: Re-released for DXP Platform.; Publisher: Altium Limited; Class II: LED
R5-R8 R20 R21 R36 R44 R69 R70 = RES: Resistor; Fitted: True
RA1 RA13-RA17 RA20 RA25-RA32 = MNR34: 3216x4 Resistor Array; Fitted: True
U6 = M25P10-VMN6: 8 Mbit Flash Serial Prom; Fitted: True
U7 = M25P20-VMN6: 8 Mbit Flash Serial Prom; Fitted: True
U8 = XC2S100E-6TQ144C: Spartan-IIE 1.8V FPGA, 144-Pin TQFP, Standard Performance, Commercial Grade; Manufacturer: Xilinx; Package Information: Latest Revision: ver1.1, Oct-2002; Class I: Field Programmable Gate Array; Code - JEDEC: MS-026-BFB; Code - IPC: SQFP20X20-144; Fitted: True; Published: 19-Jul-2002; Revision: 25-Aug-2003; Datasheet: Latest Revision: 14-Feb-2003; Package Reference: TQ144; Publisher: Altium Limited; Class II: Spartan-IIE